# EAGLE design 01 (EAGLE 9.6.2)

## Sheet 1 of 4
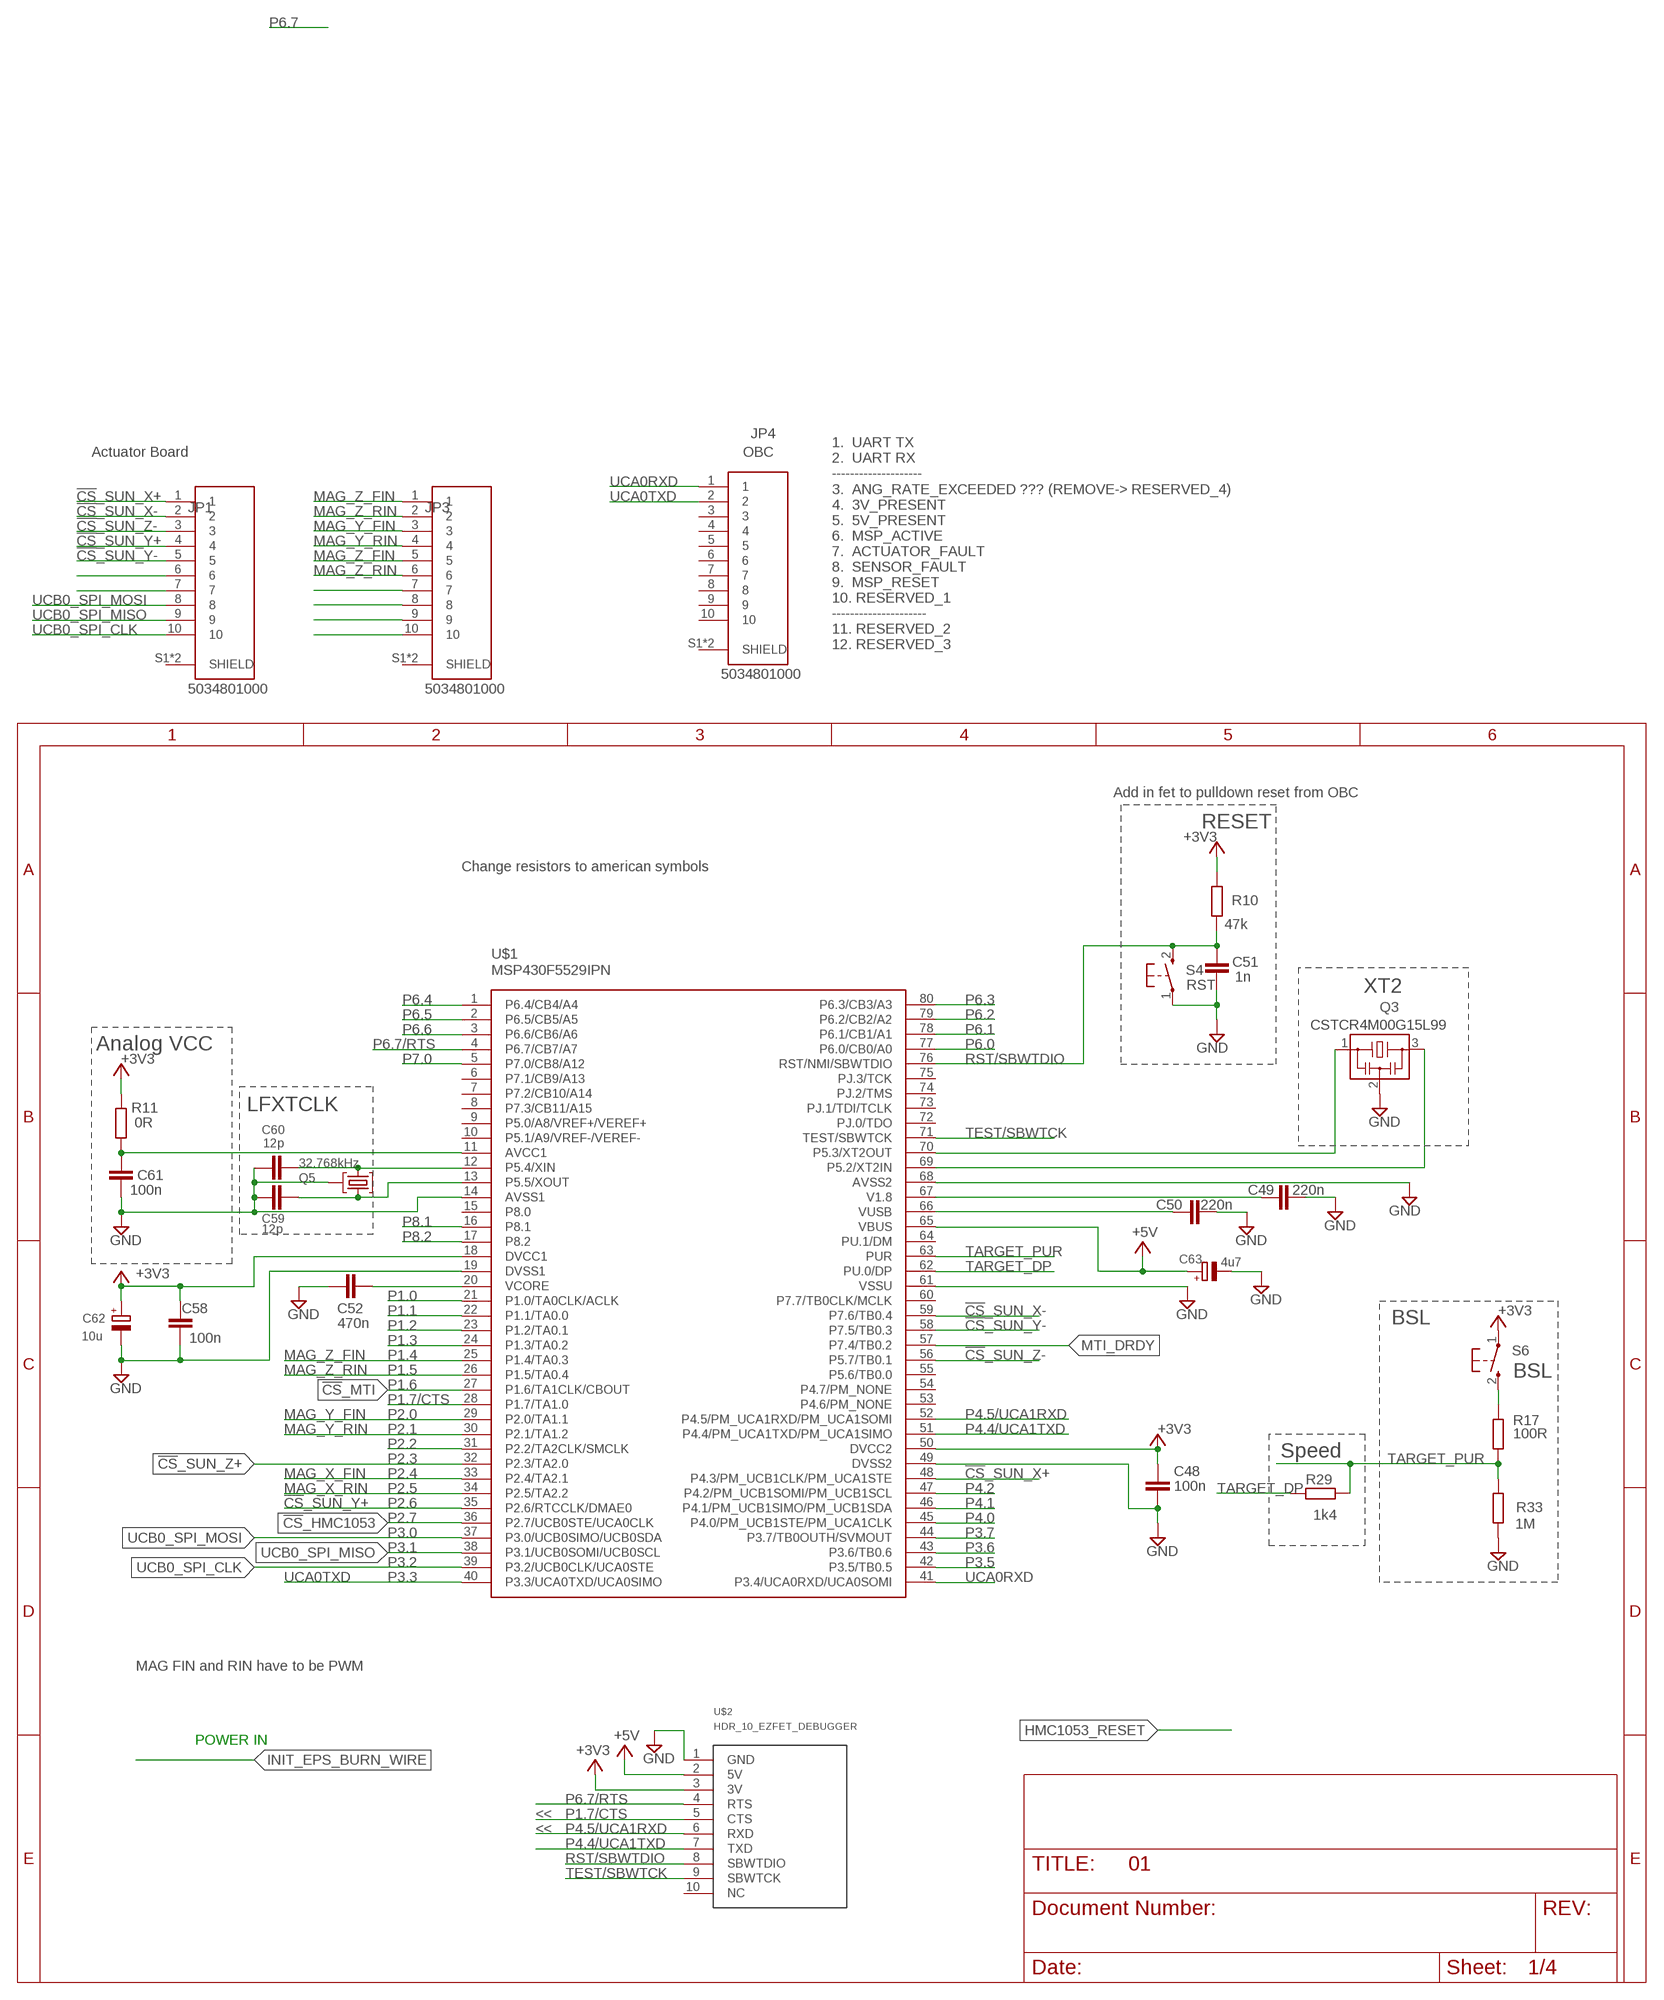
[diagram p0: schematic, sheet 1]

### Parts
C48  100n  C-EUCM0402  [0402]
C49  220n  C-EUCM0402  [0402]
C50  220n  C-EUCM0402  [0402]
C51  1n  C-EUCM0402  [0402]
C52  470n  C-EUCM0402  [0402]
C58  100n  C-EUCM0402  [0402]
C59  12p  C-EUCM0402  [0402]
C60  12p  C-EUCM0402  [0402]
C61  100n  C-EUCM0402  [0402]
C62  10u  CPOL-EUA/3216-18R  [A/3216-18R]
C63  4u7  CPOL-EUA/3216-18R  [A/3216-18R]
JP1  5034801000  [MOLEX_5034801000]
JP3  5034801000  [MOLEX_5034801000]
JP4  5034801000  [MOLEX_5034801000]
Q3  CSTCR4M00G15L99  MURATA-FILTER_CSTCR6M00G53Z  [MURATA-FILTER_CSTCR]
Q5  32.768kHz  MS3V-T1R  [MS3V-T1R]
R10  47k  R-EU_RM0402  [0402]
R11  0R  R-EU_RM0402  [0402]
R17  100R  R-EU_RM0402  [0402]
R29  1k4  R-EU_RM0402  [0402]
R33  1M  R-EU_RM0402  [0402]
S4  RST  PB  [PBTH]
S6  BSL  PB  [PBTH]
U$1  MSP430F5529IPN  [QFP80P50_1400X1400X160L60X22N]
U$2  HDR_10_EZFET_DEBUGGER  [HDRV10W66P254_10X1_2540X254H858]

### Nets
!CS!_HMC1053: U$1.36(P2.7/UCB0STE/UCA0CLK) ; also sheet 2,3
!CS!_MTI: U$1.27(P1.6/TA1CLK/CBOUT)
!CS!_SUN_X+: JP1.1 U$1.48(P4.3/PM_UCB1CLK/PM_UCA1STE)
!CS!_SUN_X-: JP1.2 U$1.59(P7.6/TB0.4)
!CS!_SUN_Y+: JP1.4 U$1.35(P2.6/RTCCLK/DMAE0)
!CS!_SUN_Y-: JP1.5 U$1.58(P7.5/TB0.3)
!CS!_SUN_Z+: U$1.32(P2.3/TA2.0)
!CS!_SUN_Z-: JP1.3 U$1.56(P5.7/TB0.1) ; also sheet 4
+3V3: C48.1 C58.2 C62.+ R10.2 R11.2 S6.1(P) U$1.18(DVCC1) U$1.50(DVCC2) U$2.3(3V) ; also sheet 2,3,4
+5V: C63.+ U$1.65(VBUS) U$2.2(5V) ; also sheet 4
AVCC1 [Power]: C61.1 R11.1 U$1.11(AVCC1)
GND: C48.2 C49.2 C50.2 C51.2 C52.1 C58.1 C59.1 C60.1 C61.2 C62.- C63.- Q3.2 Q5.P3(GND) R33.1 S4.1(P) U$1.14(AVSS1) U$1.19(DVSS1) U$1.49(DVSS2) U$1.61(VSSU) U$1.68(AVSS2) U$2.1(GND) ; also sheet 2,3,4
MAG_X_FIN: U$1.33(P2.4/TA2.1)
MAG_X_RIN: U$1.34(P2.5/TA2.2)
MAG_Y_FIN: JP3.3 U$1.29(P2.0/TA1.1)
MAG_Y_RIN: JP3.4 U$1.30(P2.1/TA1.2)
MAG_Z_FIN: JP3.1 JP3.5 U$1.25(P1.4/TA0.3)
MAG_Z_RIN: JP3.2 JP3.6 U$1.26(P1.5/TA0.4)
MTI_DRDY: U$1.57(P7.4/TB0.2) ; also sheet 3
N$6: JP1.6
N$8: JP1.7
N$11: JP3.7
N$12: R17.1 S6.2(S)
N$13: JP3.8
N$15: JP3.9
N$16: JP3.10
P1.0: U$1.21(P1.0/TA0CLK/ACLK)
P1.1: U$1.22(P1.1/TA0.0)
P1.2: U$1.23(P1.2/TA0.1)
P1.3: U$1.24(P1.3/TA0.2)
P1.7/CTS: U$1.28(P1.7/TA1.0) U$2.5(CTS)
P2.2: U$1.31(P2.2/TA2CLK/SMCLK)
P3.5: U$1.42(P3.5/TB0.5)
P3.6: U$1.43(P3.6/TB0.6)
P3.7: U$1.44(P3.7/TB0OUTH/SVMOUT)
P4.0: U$1.45(P4.0/PM_UCB1STE/PM_UCA1CLK)
P4.1: U$1.46(P4.1/PM_UCB1SIMO/PM_UCB1SDA)
P4.2: U$1.47(P4.2/PM_UCB1SOMI/PM_UCB1SCL)
P4.4/UCA1TXD: U$1.51(P4.4/PM_UCA1TXD/PM_UCA1SIMO) U$2.7(TXD)
P4.5/UCA1RXD: U$1.52(P4.5/PM_UCA1RXD/PM_UCA1SOMI) U$2.6(RXD)
P5.2/XT2IN1: Q3.3 U$1.69(P5.2/XT2IN)
P5.3/XT2OUT1: Q3.1 U$1.70(P5.3/XT2OUT)
P5.4/XIN1: C60.2 Q5.P2 U$1.12(P5.4/XIN)
P5.5/XOUT1: C59.2 Q5.P1 U$1.13(P5.5/XOUT)
P6.0: U$1.77(P6.0/CB0/A0)
P6.1: U$1.78(P6.1/CB1/A1)
P6.2: U$1.79(P6.2/CB2/A2)
P6.3: U$1.80(P6.3/CB3/A3)
P6.4: U$1.1(P6.4/CB4/A4)
P6.5: U$1.2(P6.5/CB5/A5)
P6.6: U$1.3(P6.6/CB6/A6)
P6.7/RTS: U$1.4(P6.7/CB7/A7) U$2.4(RTS)
P7.0: U$1.5(P7.0/CB8/A12)
P8.1: U$1.16(P8.1)
P8.2: U$1.17(P8.2)
RST/SBWTDIO: C51.1 R10.1 S4.2(S) U$1.76(RST/NMI/SBWTDIO) U$2.8(SBWTDIO)
TARGET_DP: R29.2 U$1.62(PU.0/DP)
TARGET_PUR: R17.2 R29.1 R33.2 U$1.63(PUR)
TARGET_VUSB1 [Power]: C50.1 U$1.66(VUSB)
TEST/SBWTCK: U$1.71(TEST/SBWTCK) U$2.9(SBWTCK)
UCA0RXD: JP4.1 U$1.41(P3.4/UCA0RXD/UCA0SOMI)
UCA0TXD: JP4.2 U$1.40(P3.3/UCA0TXD/UCA0SIMO)
UCB0_SPI_CLK: JP1.10 U$1.39(P3.2/UCB0CLK/UCA0STE) ; also sheet 2,3,4
UCB0_SPI_MISO: JP1.9 U$1.38(P3.1/UCB0SOMI/UCB0SCL) ; also sheet 2,3,4
UCB0_SPI_MOSI: JP1.8 U$1.37(P3.0/UCB0SIMO/UCB0SDA) ; also sheet 2,3,4
V1 [Power]: C49.1 U$1.67(V1.8)
VCORE1 [Power]: C52.2 U$1.20(VCORE)
Unconnected: JP1.S1(SHIELD) JP1.S2(SHIELD) JP3.S1(SHIELD) JP3.S2(SHIELD) JP4.3 JP4.4 JP4.5 JP4.6 JP4.7 JP4.8 JP4.9 JP4.10 JP4.S1(SHIELD) JP4.S2(SHIELD) U$1.6(P7.1/CB9/A13) U$1.7(P7.2/CB10/A14) U$1.8(P7.3/CB11/A15) U$1.9(P5.0/A8/VREF+/VEREF+) U$1.10(P5.1/A9/VREF-/VEREF-) U$1.15(P8.0) U$1.53(P4.6/PM_NONE) U$1.54(P4.7/PM_NONE) U$1.55(P5.6/TB0.0) U$1.60(P7.7/TB0CLK/MCLK) U$1.64(PU.1/DM) U$1.72(PJ.0/TDO) U$1.73(PJ.1/TDI/TCLK) U$1.74(PJ.2/TMS) U$1.75(PJ.3/TCK) U$2.10(NC)

### Notes on the sheet
- Actuator Board | OBC
- 1.  UART TX
  2.  UART RX
  --------------------
  3.  ANG_RATE_EXCEEDED ??? (REMOVE-> RESERVED_4)
  4.  3V_PRESENT
  5.  5V_PRESENT
  6.  MSP_ACTIVE
  7.  ACTUATOR_FAULT
  8.  SENSOR_FAULT
  9.  MSP_RESET
  10. RESERVED_1
  --------------------- 
  11. RESERVED_2
  12. RESERVED_3
- Add in fet to pulldown reset from OBC
- RESET
- Change resistors to american symbols
- XT2
- Analog VCC
- LFXTCLK
- BSL
- P1.4
- P1.5
- P1.6
- P2.0
- P2.1
- Speed
- P2.3
- P2.4
- P2.5
- P2.6
- P2.7
- P3.0
- P3.1
- P3.2
- P3.3
- MAG FIN and RIN have to be PWM
- POWER IN
- <<
- <<

## Sheet 2 of 4
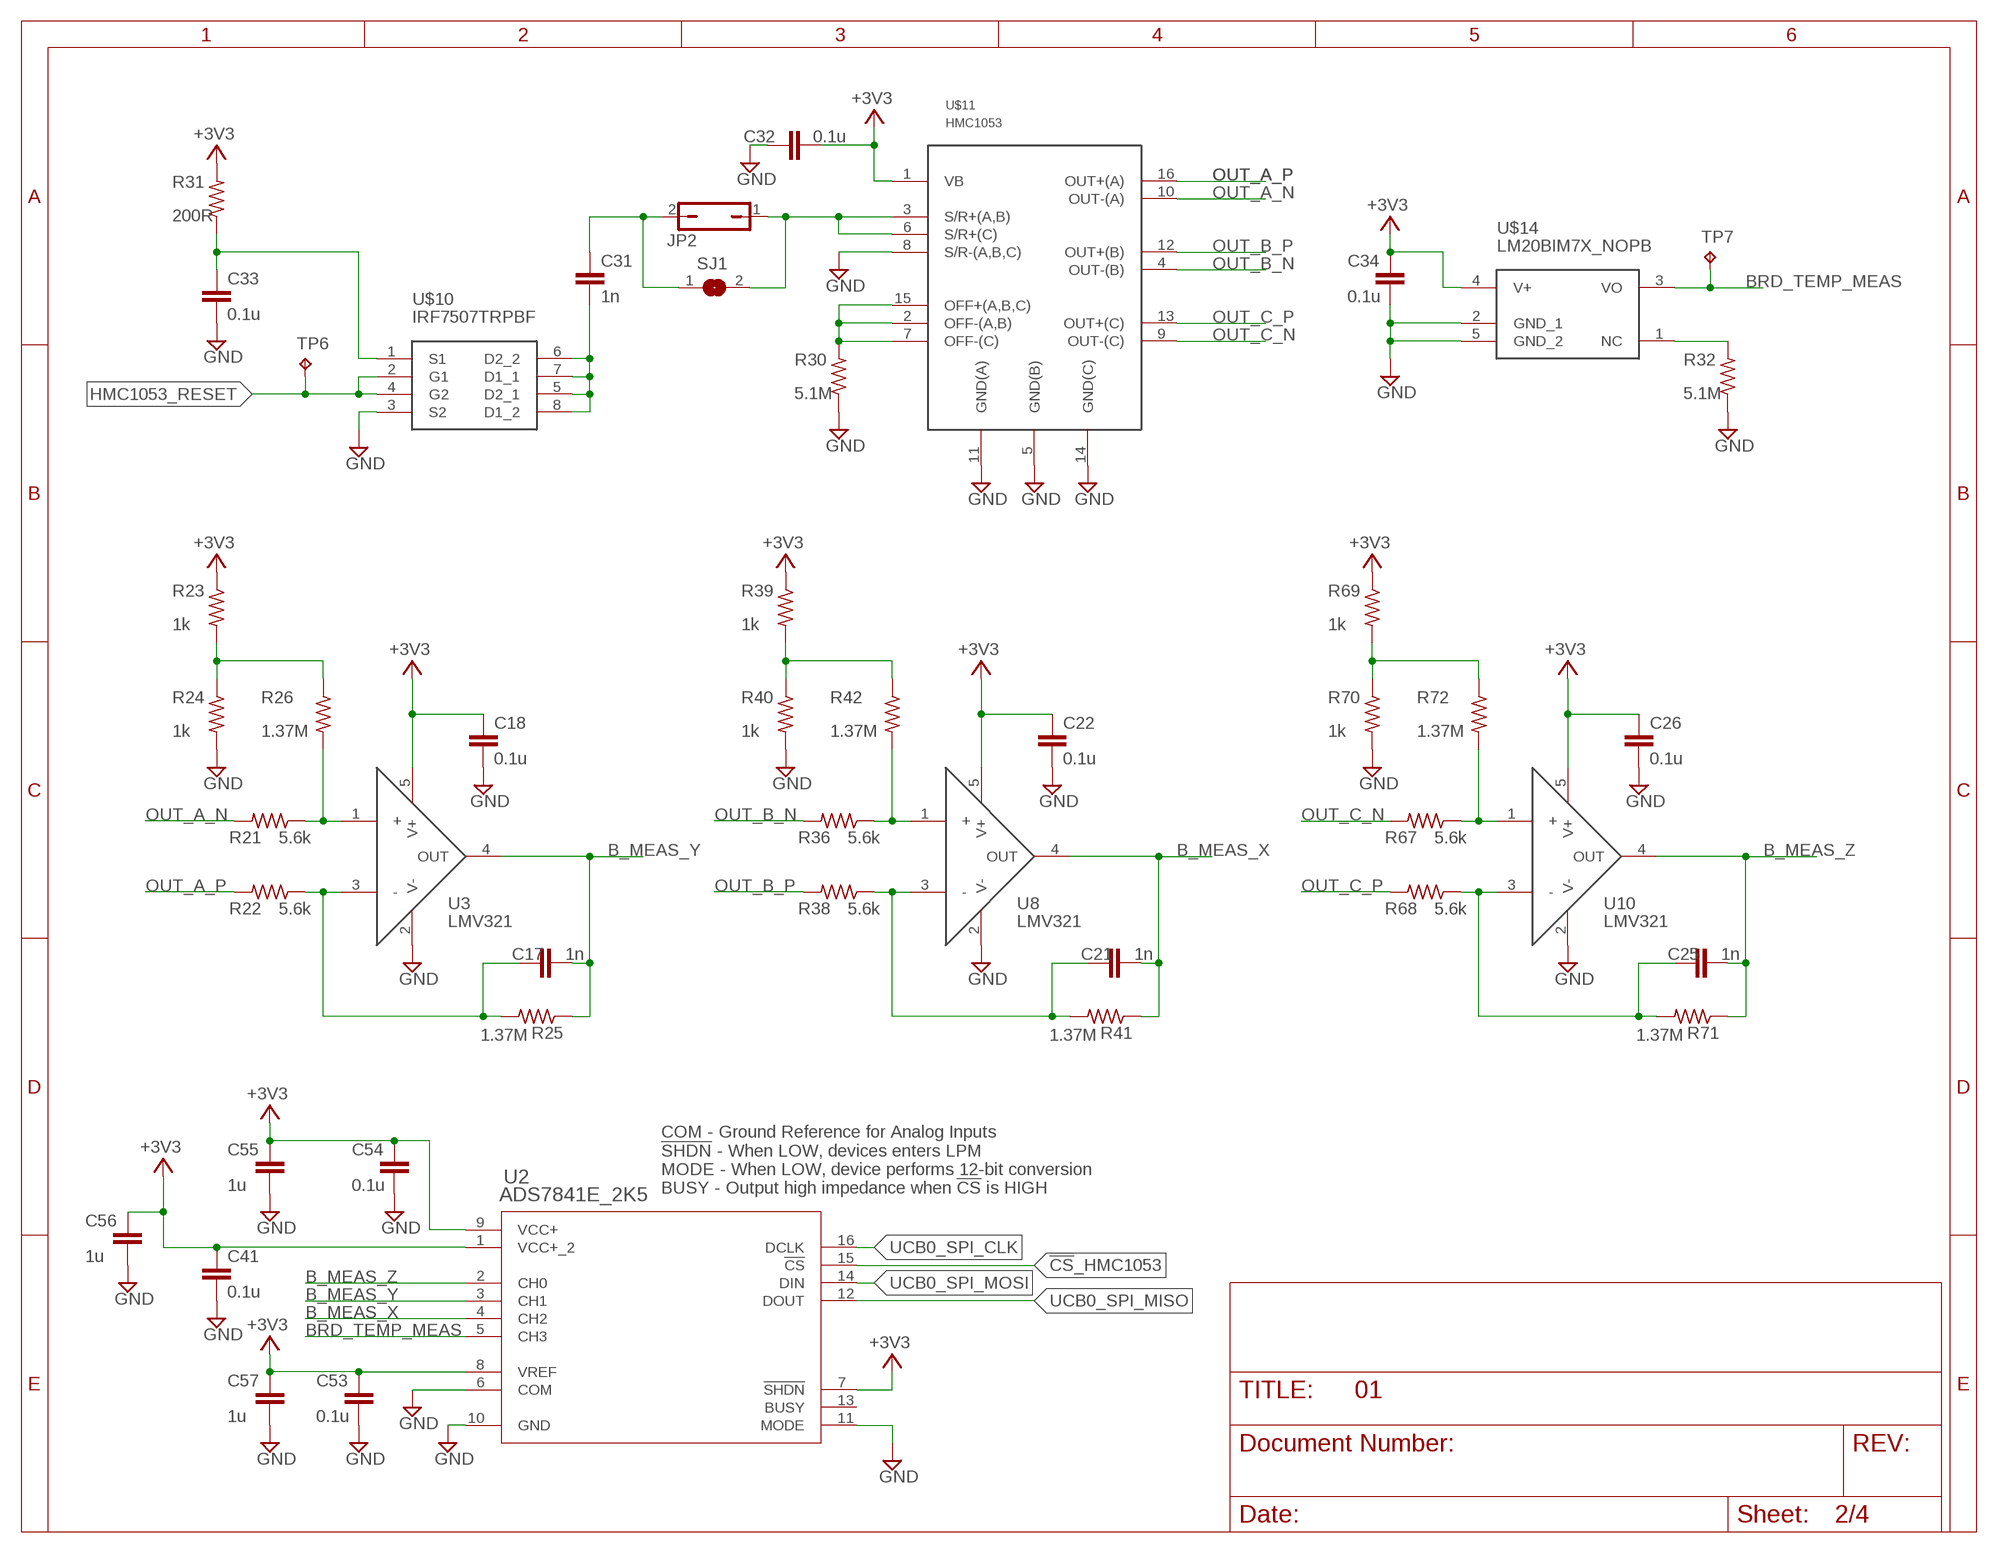
[diagram p1: schematic, sheet 2]

### Parts
C17  1n  C-EUC0805  [C0805]
C18  0.1u  C-EUC0603  [C0603]
C21  1n  C-EUC0805  [C0805]
C22  0.1u  C-EUC0603  [C0603]
C25  1n  C-EUC0805  [C0805]
C26  0.1u  C-EUC0603  [C0603]
C31  1n  C-EUC1206  [C1206]
C32  0.1u  C-EUC0603  [C0603]
C33  0.1u  C-EUC0603  [C0603]
C34  0.1u  C-EUC0603  [C0603]
C41  0.1u  C-EUC0603  [C0603]
C53  0.1u  C-EUC0603  [C0603]
C54  0.1u  C-EUC0603  [C0603]
C55  1u  C-EUC1206  [C1206]
C56  1u  C-EUC1206  [C1206]
C57  1u  C-EUC1206  [C1206]
JP2  JP1Q  [JP1]
R21  5.6k  R-US_R0805  [R0805]
R22  5.6k  R-US_R0805  [R0805]
R23  1k  R-US_R0805  [R0805]
R24  1k  R-US_R0805  [R0805]
R25  1.37M  R-US_R0805  [R0805]
R26  1.37M  R-US_R0805  [R0805]
R30  5.1M  R-US_R1206  [R1206]
R31  200R  R-US_R1206  [R1206]
R32  5.1M  R-US_R1206  [R1206]
R36  5.6k  R-US_R0805  [R0805]
R38  5.6k  R-US_R0805  [R0805]
R39  1k  R-US_R0805  [R0805]
R40  1k  R-US_R0805  [R0805]
R41  1.37M  R-US_R0805  [R0805]
R42  1.37M  R-US_R0805  [R0805]
R67  5.6k  R-US_R0805  [R0805]
R68  5.6k  R-US_R0805  [R0805]
R69  1k  R-US_R0805  [R0805]
R70  1k  R-US_R0805  [R0805]
R71  1.37M  R-US_R0805  [R0805]
R72  1.37M  R-US_R0805  [R0805]
SJ1  SJ  [SJ]
TP6  TPPAD1-13  [P1-13]
TP7  TPB1,27  [B1,27]
U2  ADS7841E_2K5  [DBQ16]
U3  LMV321  [SOT23-5P65_210X110L36X22N]
U8  LMV321  [SOT23-5P65_210X110L36X22N]
U10  LMV321  [SOT23-5P65_210X110L36X22N]
U$10  IRF7507TRPBF  [SOP8P65_300X490X111L53X30N]
U$11  HMC1053  [LCCS16P127_736X736X279L127X50N]
U$14  LM20BIM7X_NOPB  [SOT23-5P65_210X110L40X22N_LM20]

### Nets
!CS!_HMC1053: U2.15(!CS) ; also sheet 1,3
+3V3: C18.1 C22.1 C26.1 C32.1 C34.2 C41.1 C53.1 C54.1 C55.1 C56.1 C57.1 R23.1 R31.2 R39.1 R69.1 U2.1(VCC+_2) U2.7(!SHDN) U2.8(VREF) U2.9(VCC+) U3.5(V+) U8.5(V+) U10.5(V+) U$11.1(VB) U$14.4(V+) ; also sheet 1,3,4
B_MEAS_X: C21.2 R41.1 U2.4(CH2) U8.4(OUT)
B_MEAS_Y: C17.2 R25.1 U2.3(CH1) U3.4(OUT)
B_MEAS_Z: C25.2 R71.1 U2.2(CH0) U10.4(OUT)
BRD_TEMP_MEAS: TP7.TP U2.5(CH3) U$14.3(VO)
GND: C18.2 C22.2 C26.2 C32.2 C33.1 C34.1 C41.2 C53.2 C54.2 C55.2 C56.2 C57.2 R24.2 R30.1 R32.1 R40.2 R70.2 U2.6(COM) U2.10(GND) U2.11(MODE) U3.2(V-) U8.2(V-) U10.2(V-) U$10.3(S2) U$11.5(GND(B)) U$11.8(S/R-(A,B,C)) U$11.11(GND(A)) U$11.14(GND(C)) U$14.2(GND_1) U$14.5(GND_2) ; also sheet 1,3,4
HMC1053_RESET: TP6.TP U$10.2(G1) U$10.4(G2) ; also sheet 1
N$20: R23.2 R24.1 R26.1
N$21: C17.1 R22.1 R25.2 U3.3(-)
N$23: R21.1 R26.2 U3.1(+)
N$35: C31.2 JP2.2 SJ1.1
N$36: R30.2 U$11.2(OFF-(A,B)) U$11.7(OFF-(C)) U$11.15(OFF+(A,B,C))
N$37: JP2.1 SJ1.2 U$11.3(S/R+(A,B)) U$11.6(S/R+(C))
N$38: C31.1 U$10.5(D2_1) U$10.6(D2_2) U$10.7(D1_1) U$10.8(D1_2)
N$39: C33.2 R31.1 U$10.1(S1)
N$40: R32.2 U$14.1(NC)
N$49: R39.2 R40.1 R42.1
N$50: C21.1 R38.1 R41.2 U8.3(-)
N$52: R36.1 R42.2 U8.1(+)
N$59: R69.2 R70.1 R72.1
N$60: C25.1 R68.1 R71.2 U10.3(-)
N$62: R67.1 R72.2 U10.1(+)
OUT_A_N: R21.2 U$11.10(OUT-(A))
OUT_A_P: R22.2 U$11.16(OUT+(A))
OUT_B_N [Ground]: R36.2 U$11.4(OUT-(B))
OUT_B_P [Ground]: R38.2 U$11.12(OUT+(B))
OUT_C_N [Ground]: R67.2 U$11.9(OUT-(C))
OUT_C_P [Ground]: R68.2 U$11.13(OUT+(C))
UCB0_SPI_CLK: U2.16(DCLK) ; also sheet 1,3,4
UCB0_SPI_MISO: U2.12(DOUT) ; also sheet 1,3,4
UCB0_SPI_MOSI: U2.14(DIN) ; also sheet 1,3,4
Unconnected: U2.13(BUSY)

### Notes on the sheet
- COM - Ground Reference for Analog Inputs
  !SHDN! - When LOW, devices enters LPM
  MODE - When LOW, device performs 12-bit conversion
  BUSY - Output high impedance when !CS! is HIGH

## Sheet 3 of 4
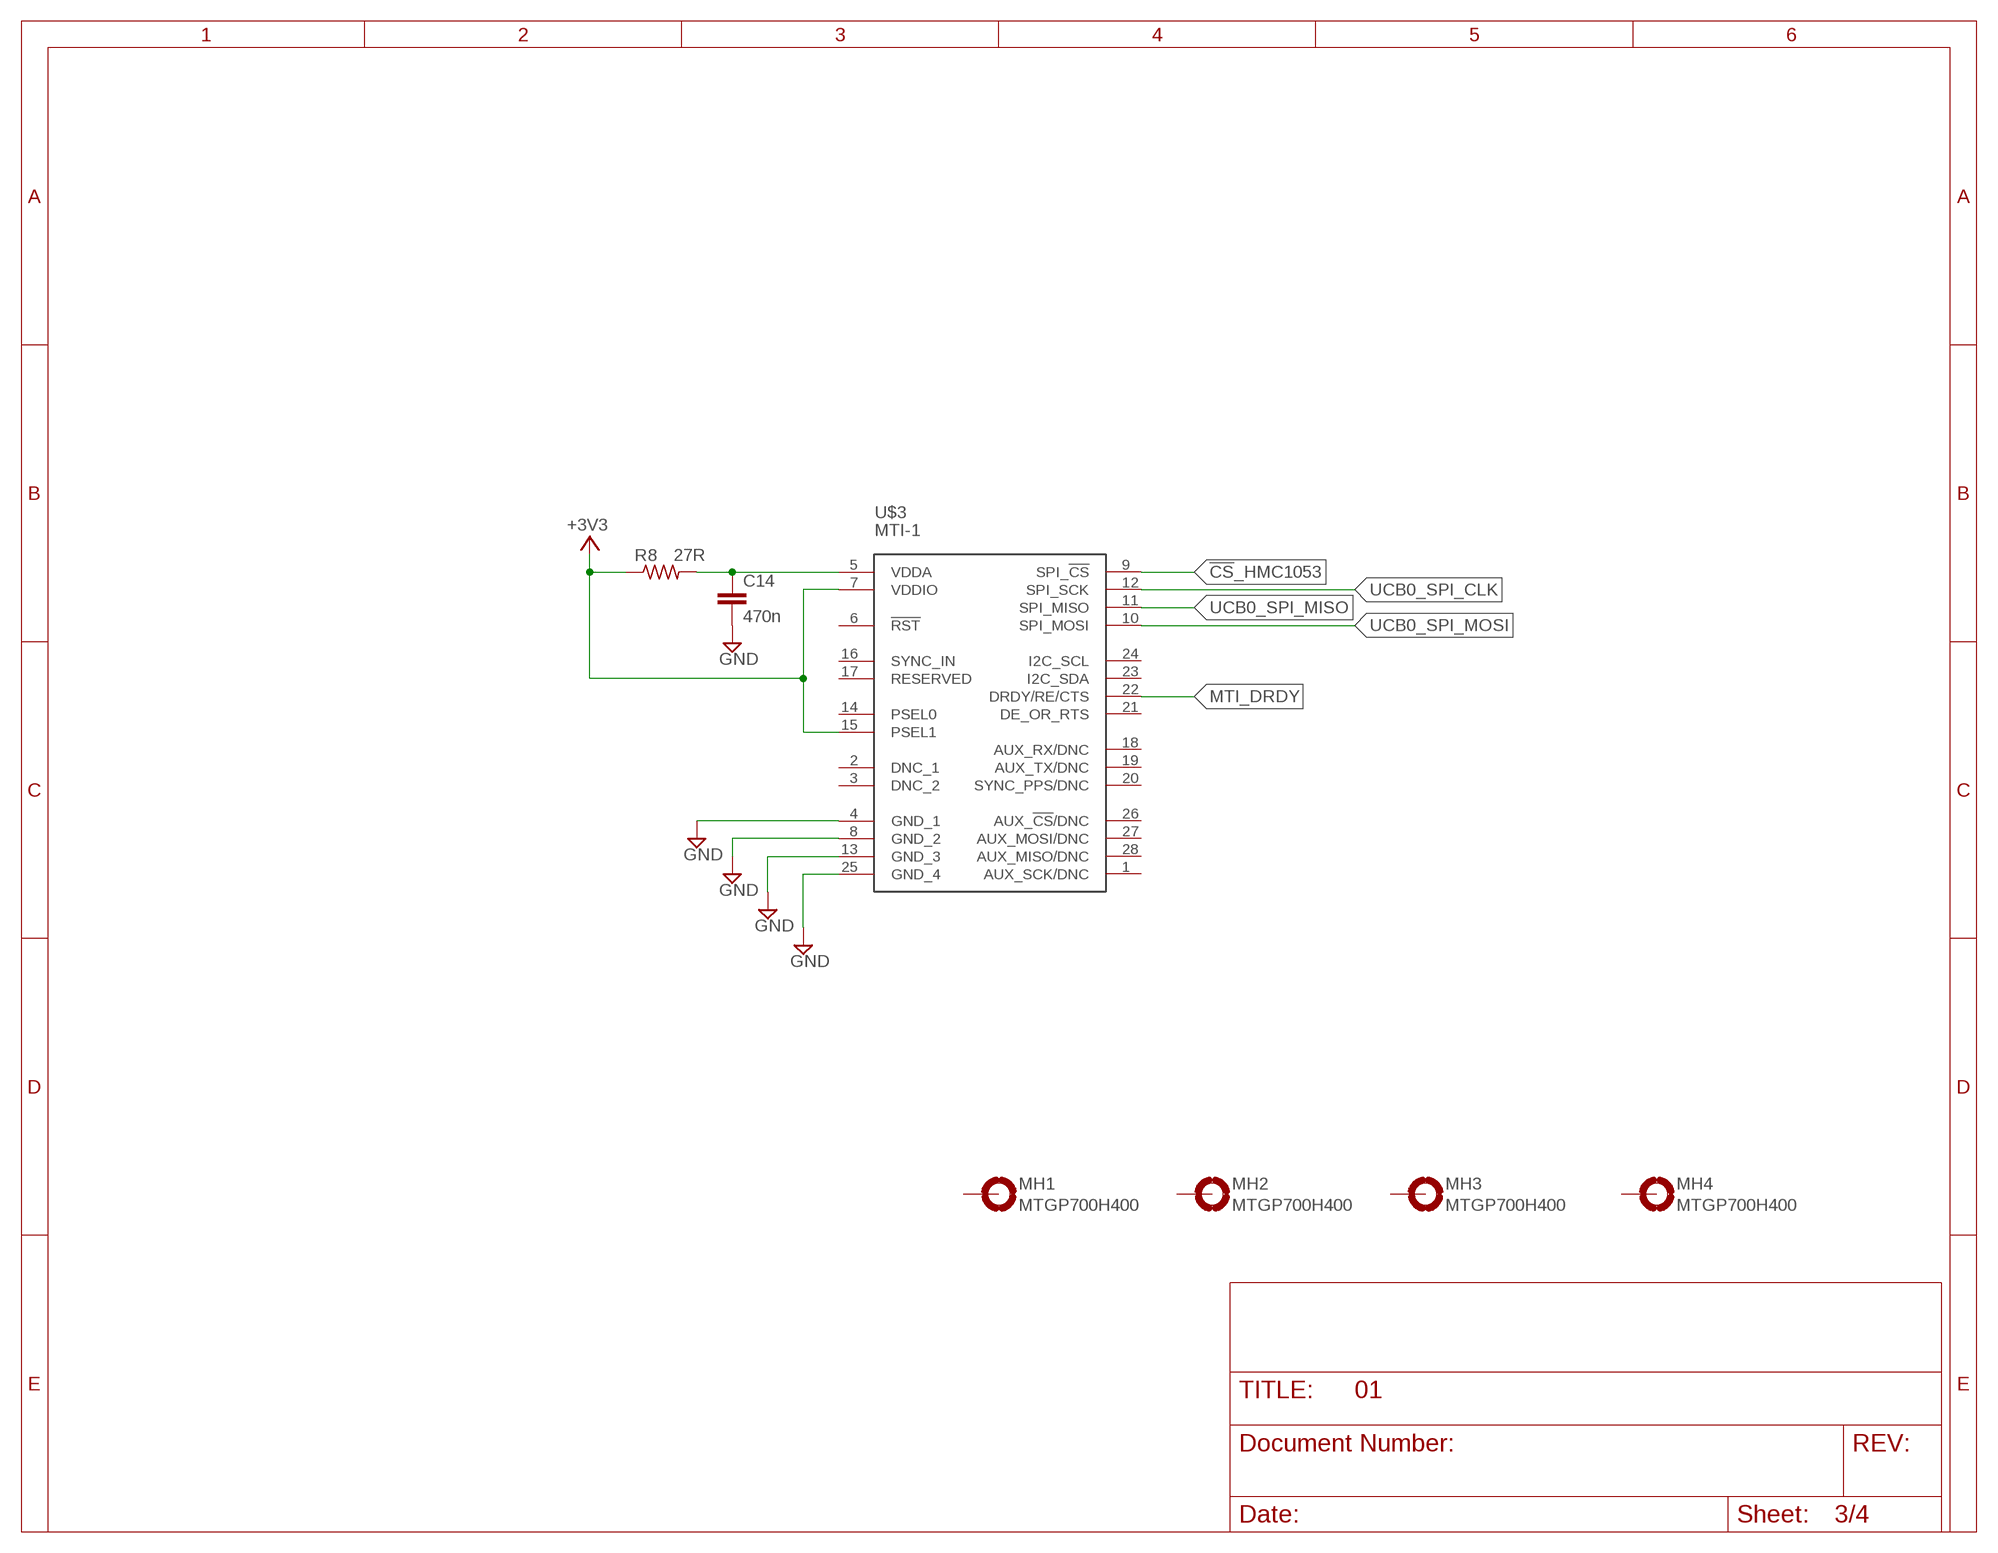
[diagram p2: schematic, sheet 3]

### Parts
C14  470n  C-EUC0805  [C0805]
MH1  MTGP700H400  [MTGP700H400]
MH2  MTGP700H400  [MTGP700H400]
MH3  MTGP700H400  [MTGP700H400]
MH4  MTGP700H400  [MTGP700H400]
R8  27R  R-US_R0805  [R0805]
U$3  MTI-1  [LCC28P127_1210X1210X260L90X63_MTI-1]

### Nets
!CS!_HMC1053: U$3.9(SPI_!CS) ; also sheet 1,2
+3V3: R8.1 U$3.7(VDDIO) U$3.15(PSEL1) ; also sheet 1,2,4
GND: C14.1 U$3.4(GND_1) U$3.8(GND_2) U$3.13(GND_3) U$3.25(GND_4) ; also sheet 1,2,4
MTI_DRDY: U$3.22(DRDY/RE/CTS) ; also sheet 1
N$7: C14.2 R8.2 U$3.5(VDDA)
UCB0_SPI_CLK: U$3.12(SPI_SCK) ; also sheet 1,2,4
UCB0_SPI_MISO: U$3.11(SPI_MISO) ; also sheet 1,2,4
UCB0_SPI_MOSI: U$3.10(SPI_MOSI) ; also sheet 1,2,4
Unconnected: MH1.1(MOUNT) MH2.1(MOUNT) MH3.1(MOUNT) MH4.1(MOUNT) U$3.1(AUX_SCK/DNC) U$3.2(DNC_1) U$3.3(DNC_2) U$3.6(!RST) U$3.14(PSEL0) U$3.16(SYNC_IN) U$3.17(RESERVED) U$3.18(AUX_RX/DNC) U$3.19(AUX_TX/DNC) U$3.20(SYNC_PPS/DNC) U$3.21(DE_OR_RTS) U$3.23(I2C_SDA) U$3.24(I2C_SCL) U$3.26(AUX_!CS!/DNC) U$3.27(AUX_MOSI/DNC) U$3.28(AUX_MISO/DNC)

## Sheet 4 of 4
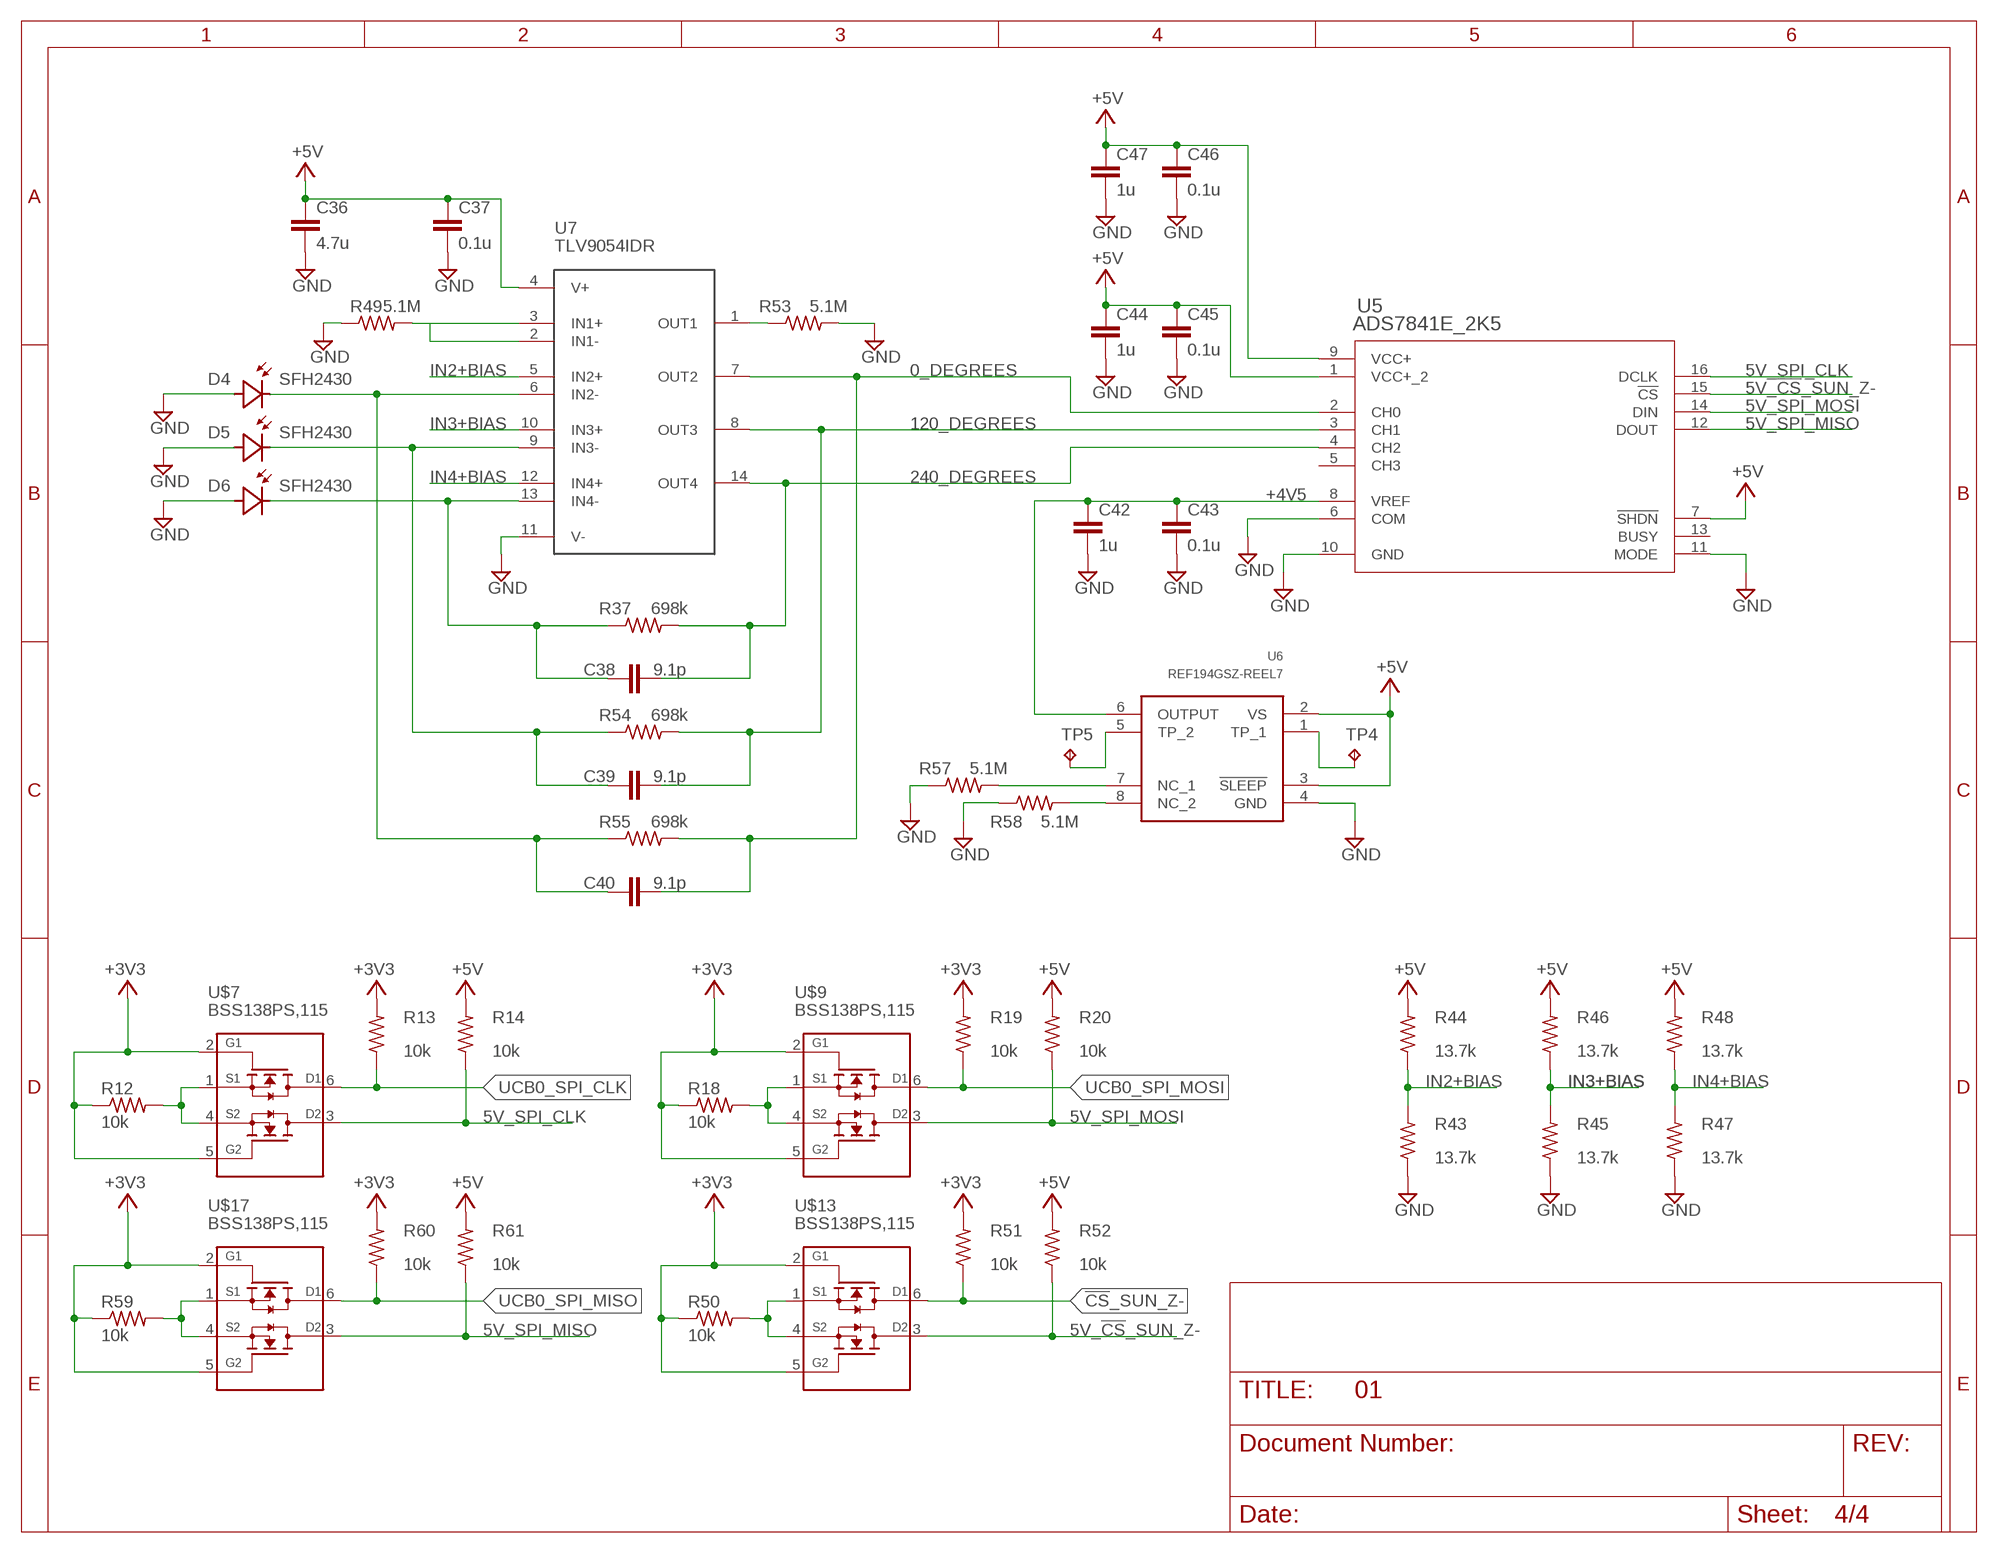
[diagram p3: schematic, sheet 4]

### Parts
C36  4.7u  C-EUC0603  [C0603]
C37  0.1u  C-EUC0603  [C0603]
C38  9.1p  C-EUC0603  [C0603]
C39  9.1p  C-EUC0603  [C0603]
C40  9.1p  C-EUC0603  [C0603]
C42  1u  C-EUC0603  [C0603]
C43  0.1u  C-EUC0603  [C0603]
C44  1u  C-EUC0603  [C0603]
C45  0.1u  C-EUC0603  [C0603]
C46  0.1u  C-EUC0603  [C0603]
C47  1u  C-EUC0603  [C0603]
D4  SFH2430  [JP1Y_LED_SCREEN]
D5  SFH2430  [JP1Y_LED_SCREEN]
D6  SFH2430  [JP1Y_LED_SCREEN]
R12  10k  R-US_R0402  [R0402]
R13  10k  R-US_R0402  [R0402]
R14  10k  R-US_R0402  [R0402]
R18  10k  R-US_R0402  [R0402]
R19  10k  R-US_R0402  [R0402]
R20  10k  R-US_R0402  [R0402]
R37  698k  R-US_R0603  [R0603]
R43  13.7k  R-US_R0603  [R0603]
R44  13.7k  R-US_R0603  [R0603]
R45  13.7k  R-US_R0603  [R0603]
R46  13.7k  R-US_R0603  [R0603]
R47  13.7k  R-US_R0603  [R0603]
R48  13.7k  R-US_R0603  [R0603]
R49  5.1M  R-US_R0603  [R0603]
R50  10k  R-US_R0402  [R0402]
R51  10k  R-US_R0402  [R0402]
R52  10k  R-US_R0402  [R0402]
R53  5.1M  R-US_R0603  [R0603]
R54  698k  R-US_R0603  [R0603]
R55  698k  R-US_R0603  [R0603]
R57  5.1M  R-US_R0603  [R0603]
R58  5.1M  R-US_R0603  [R0603]
R59  10k  R-US_R0402  [R0402]
R60  10k  R-US_R0402  [R0402]
R61  10k  R-US_R0402  [R0402]
TP4  TPB1,27  [B1,27]
TP5  TPB1,27  [B1,27]
U5  ADS7841E_2K5  [DBQ16]
U6  REF194GSZ-REEL7  [SOIC8P127_490X600X175L83X41N_REF194GSZ-REEL7]
U7  TLV9054IDR  [SOIC14P127_865X600X175L83X41N_TLV9054IDR]
U$7  BSS138PS,115  [SOT23-6P65_200X110L30X25N_BSS138PS,115]
U$9  BSS138PS,115  [SOT23-6P65_200X110L30X25N_BSS138PS,115]
U$13  BSS138PS,115  [SOT23-6P65_200X110L30X25N_BSS138PS,115]
U$17  BSS138PS,115  [SOT23-6P65_200X110L30X25N_BSS138PS,115]

### Nets
0_DEGREES: C40.2 R55.2 U5.2(CH0) U7.7(OUT2)
5V_!CS!_SUN_Z-: R52.1 U5.15(!CS) U$13.3(D2)
5V_SPI_CLK: R14.1 U5.16(DCLK) U$7.3(D2)
5V_SPI_MISO: R61.1 U5.12(DOUT) U$17.3(D2)
5V_SPI_MOSI: R20.1 U5.14(DIN) U$9.3(D2)
120_DEGREES: C39.2 R54.2 U5.3(CH1) U7.8(OUT3)
240_DEGREES: C38.2 R37.2 U5.4(CH2) U7.14(OUT4)
!CS!_SUN_Z-: R51.1 U$13.6(D1) ; also sheet 1
+3V3: R12.1 R13.2 R18.1 R19.2 R50.1 R51.2 R59.1 R60.2 U$7.2(G1) U$7.5(G2) U$9.2(G1) U$9.5(G2) U$13.2(G1) U$13.5(G2) U$17.2(G1) U$17.5(G2) ; also sheet 1,2,3
+4V5: C42.1 C43.1 U5.8(VREF) U6.6(OUTPUT)
+5V: C36.1 C37.1 C44.1 C45.1 C46.1 C47.1 R14.2 R20.2 R44.2 R46.2 R48.2 R52.2 R61.2 U5.1(VCC+_2) U5.7(!SHDN) U5.9(VCC+) U6.2(VS) U6.3(!SLEEP) U7.4(V+) ; also sheet 1
GND: C36.2 C37.2 C42.2 C43.2 C44.2 C45.2 C46.2 C47.2 D4.2(A) D5.2(A) D6.2(A) R43.1 R45.1 R47.1 R49.1 R53.2 R57.1 R58.1 U5.6(COM) U5.10(GND) U5.11(MODE) U6.4(GND) U7.11(V-) ; also sheet 1,2,3
IN2+BIAS: R43.2 R44.1 U7.5(IN2+)
IN3+BIAS: R45.2 R46.1 U7.10(IN3+)
IN4+BIAS: R47.2 R48.1 U7.12(IN4+)
N$14: R12.2 U$7.1(S1) U$7.4(S2)
N$26: R49.2 U7.2(IN1-) U7.3(IN1+)
N$27: R53.1 U7.1(OUT1)
N$28: C38.1 D6.1(C) R37.1 U7.13(IN4-)
N$30: R18.2 U$9.1(S1) U$9.4(S2)
N$31: C39.1 D5.1(C) R54.1 U7.9(IN3-)
N$32: C40.1 D4.1(C) R55.1 U7.6(IN2-)
N$33: TP5.TP U6.5(TP_2)
N$34: TP4.TP U6.1(TP_1)
N$41: R57.2 U6.7(NC_1)
N$42: R50.2 U$13.1(S1) U$13.4(S2)
N$43: R58.2 U6.8(NC_2)
N$48: R59.2 U$17.1(S1) U$17.4(S2)
UCB0_SPI_CLK: R13.1 U$7.6(D1) ; also sheet 1,2,3
UCB0_SPI_MISO: R60.1 U$17.6(D1) ; also sheet 1,2,3
UCB0_SPI_MOSI: R19.1 U$9.6(D1) ; also sheet 1,2,3
Unconnected: U5.5(CH3) U5.13(BUSY)

## Library data of the parts
C14 C17 C18 C21 C22 C25 C26 C32-C34 C36-C47 C53 C54 = rcl:C-EU: CAPACITOR, European symbol; SPICEPREFIX: C
C31 C55-C57 = resistor:C-EU: CAPACITOR, European symbol
C48-C52 C58-C61 = rcl:C-EU: CAPACITOR, European symbol
C62 C63 = rcl:CPOL-EU: POLARIZED CAPACITOR, European symbol
D4-D6 = my_library:SFH2430
JP1 JP3 JP4 = my_library:5034801000: 0.50mm Pitch Easy-On™ BackFlip™ Type FPC Connector, 1.00mm Height, Right Angle, Surface Mount, Dual Contact Style; DESCRIPTION: 10 Position FFC, FPC Connector Contacts, Top and Bottom 0.020 (0.50mm) Surface Mount, Right Angle; DIGI-KEY_PART_NUMBER: WM1389CT-ND; MF: Molex; MP: 5034801000; PACKAGE: None; PURCHASE-URL: https://pricing.snapeda.com/search/part/5034801000/?ref=eda
JP2 = jumper:JP1Q: JUMPER
MH1-MH4 = my_library:MTGP700H400
Q3 = murata:MURATA-FILTER_CSTCR: Resonator Source: murata.co.jp; MPN: CSTCR6M00G53-R0; OC_FARNELL: 1170434; OC_NEWARK: 25M8759
Q5 = microcrystal:MS3V-T1R
R8 R12-R14 R18-R26 R36-R55 R57-R61 R67-R72 = rcl:R-US_: RESISTOR, American symbol; SPICEPREFIX: R
R10 R11 R17 R29 R33 = rcl:R-EU_: RESISTOR, European symbol
R30-R32 = resistor:R-US_: RESISTOR, American symbol
S4 S6 = electricalmeter:PB: OMRON SWITCH
SJ1 = jumper:SJ: SMD solder JUMPER
TP4-TP7 = testpad:TP: Test pad
U2 U5 = my_library:ADS7841E_2K5; DATASHEET_URL: http://www.ti.com/lit/gpn/ADS7841; DESCRIPTION: 12-Bit, 4-Channel Serial Output Sampling Analog-to-Digital Converter; FAMILY_NAME: PRECISION ADC (<=10MSPS); GENERIC_PART_NUMBER: ADS7841; INDUSTRY_STD_PKG_TYPE: SSOP/QSOP; MANUFACTURER: Texas Instruments; PACKAGE_DESIGNATOR: DBQ; PIN_COUNT: 16
U3 U8 U10 = my_library:LMV321
U6 = my_library:REF194GSZ-REEL7
U7 = my_library:TLV9054IDR
U$1 = my_library:MSP430F5529IPN
U$2 = my_library:HDR_10_EZFET_DEBUGGER
U$3 = my_library:MTI-1
U$7 U$9 U$13 U$17 = my_library:BSS138PS,115
U$10 = my_library:IRF7507TRPBF
U$11 = my_library:HMC1053
U$14 = my_library:LM20BIM7X_NOPB

## Net classes
0 Default: width 0.203 mm, drill 0.305 mm, clearance 0.152 mm
1 Ground: width 0.203 mm, drill 0.305 mm, clearance 0.152 mm to class 0, clearance 0.152 mm
2 Power: width 0.203 mm, drill 0.305 mm, clearance 0.152 mm to class 0, clearance 0.152 mm to class 1, clearance 0.152 mm

## Board
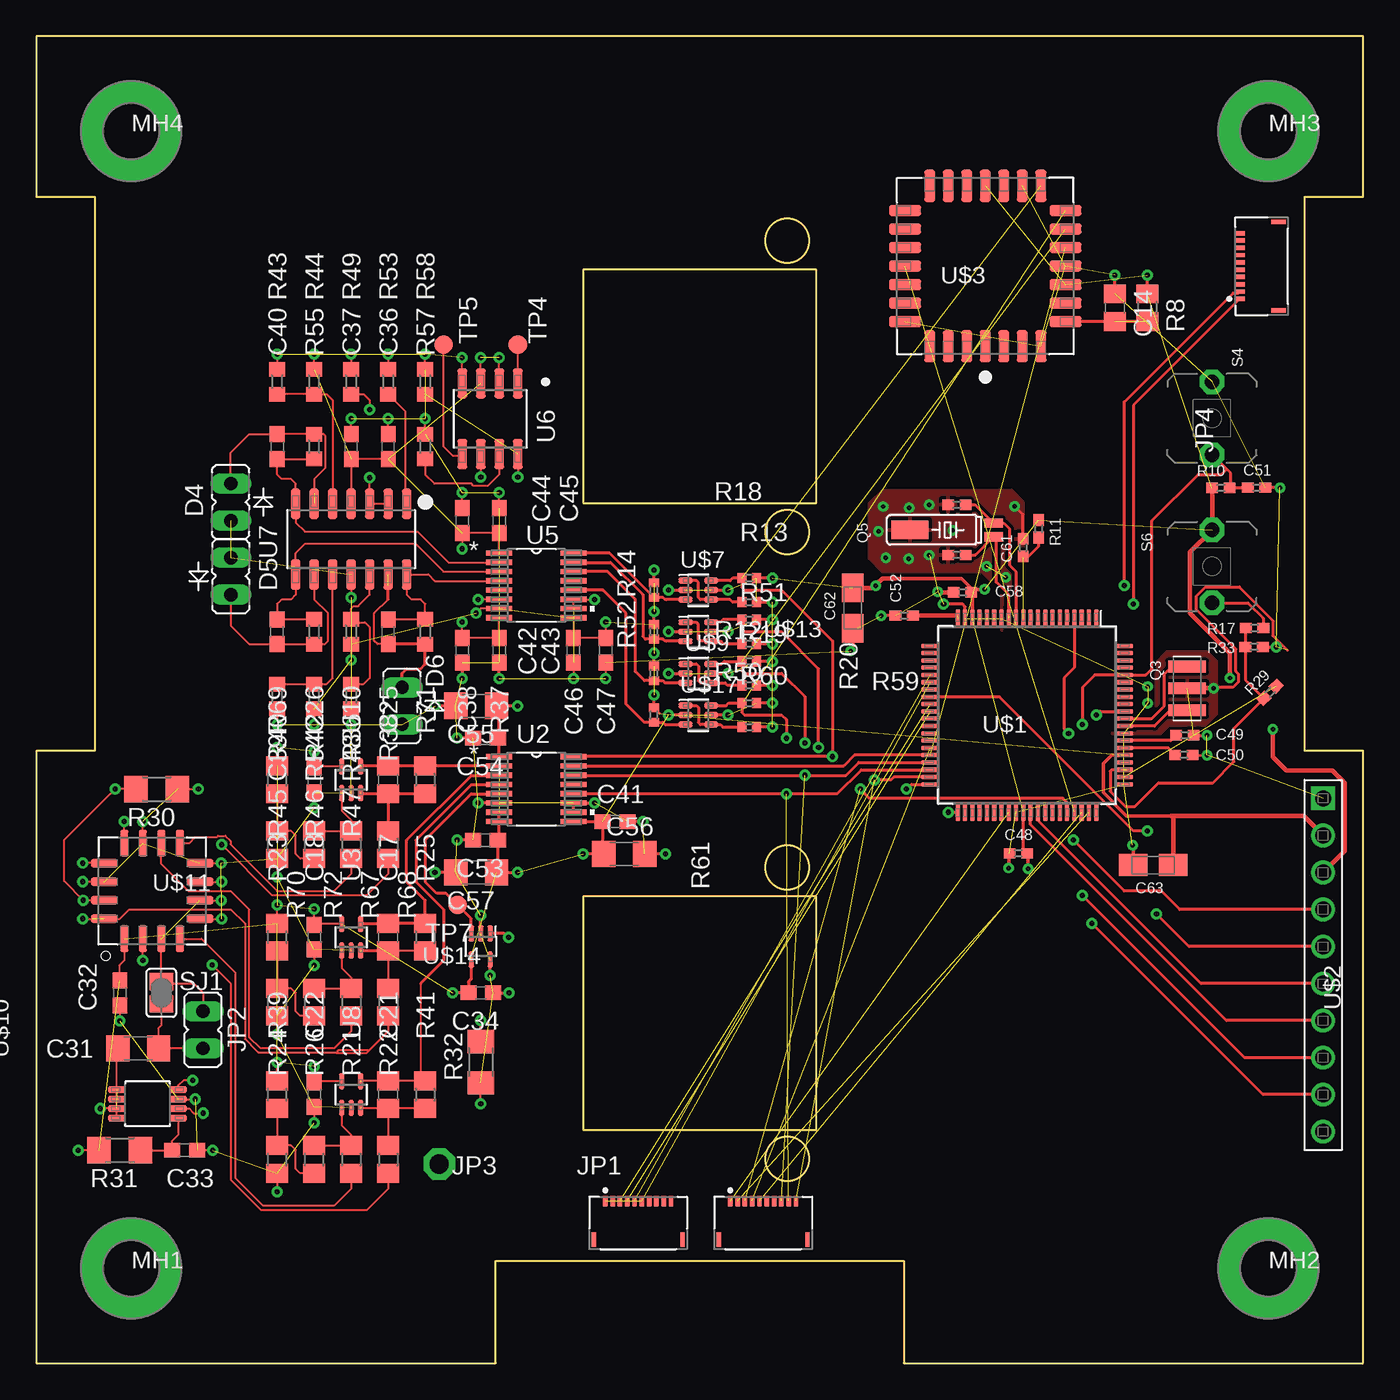
[diagram p4: board, top side]
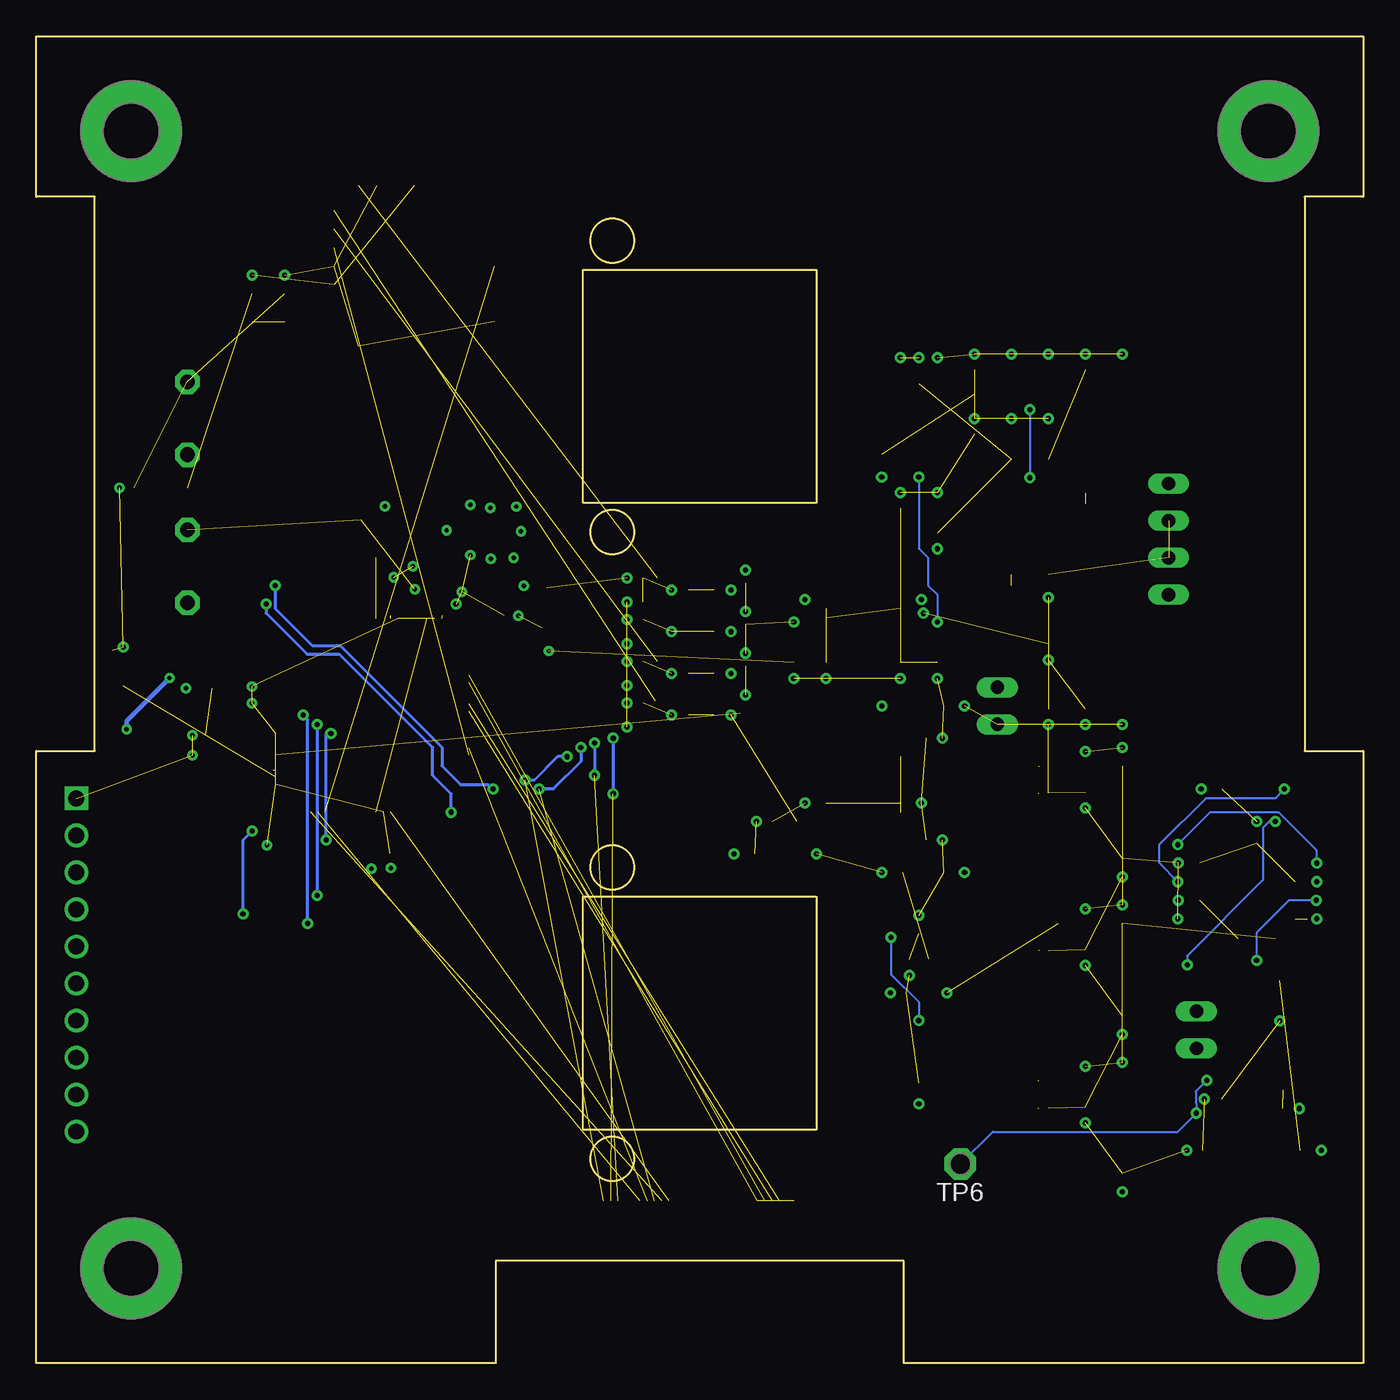
[diagram p5: board, bottom side, seen from below]

Size 91 x 91 mm. Coordinates in mm from the lower left corner, seen from the top.
Outline: 0,0 31.5,0 31.5,7 59.5,7 59.5,0 91,0 91,42 87,42 87,80 91,80 91,91 0,91 0,80 4,80 4,42 0,42 0,0
Copper layers (1*16): Top 0.035mm / dielectric 1.5mm / Bottom 0.035mm
Design rules "default": minimum track width 6mil, minimum drill 0.35mm, track to track 6mil, track to pad 6mil, pad to pad 6mil, via to via 6mil, smd to smd 6mil, copper to edge 40mil, drill to drill 6mil, minimum pad ring 10mil, minimum via ring 8mil, stop-mask expansion 4mil, vias tented up to drill 0mil, thermal gap 10mil
Milling: area 50,75.5 to 53,78.5; area 50,55.5 to 53,58.5; area 50,32.5 to 53,35.5; area 50,12.5 to 53,15.5; 8 lines

### Footprints (pad centres in the part's own frame; a part is rotated, then mirrored left to right if it is on the bottom)
C0805 = smd 1.3 x 1.5: 1 -0.95,0; 2 0.95,0
C0603 = smd 1.1 x 1: 1 -0.85,0; 2 0.85,0
C1206 = smd 1.6 x 1.8: 1 -1.4,0; 2 1.4,0
0402 = smd 0.8 x 0.7: 1 -0.6,0; 2 0.6,0
A/3216-18R = smd 1.95 x 1.5: + 1.375,0; - -1.375,0
JP1Y_LED_SCREEN = drill 0.914 long: 1 0,-1.27; 2 0,1.27
MOLEX_5034801000 = smd 0.3 x 0.7: 1 -2.25,0; 2 -1.75,0; 3 -1.25,0; 4 -0.75,0; 5 -0.25,0; 6 0.25,0; 7 0.75,0; 8 1.25,0; 9 1.75,0; 10 2.25,0 | smd 0.3 x 1: S1 -3.04,-2.65; S2 3.04,-2.65
JP1 = drill 0.914 long: 1 0,-1.27; 2 0,1.27
MTGP700H400 = drill 4 pad 7: 1 0,0
MURATA-FILTER_CSTCR = smd 0.8 x 2.6: 1 -1.5,0; 2 0,0; 3 1.5,0
MS3V-T1R = smd 0.635 x 1.27: P1 -0.47,-4.43; P2 0.47,-4.43 | smd 1.27 x 2.54: P3 0,1.3
R0805 = smd 1.3 x 1.5: 1 -0.95,0; 2 0.95,0
R0402 = smd 0.6 x 0.7: 1 -0.5,0; 2 0.5,0
R1206 = smd 1.6 x 1.803: 1 -1.422,0; 2 1.422,0
R0603 = smd 1 x 1.1: 1 -0.85,0; 2 0.85,0
PBTH = drill 1.016 pad 1.676 octagon: 1 -0.001,0.001; 2 5.001,0.001
SJ = smd 1.168 x 1.6: 1 -0.762,0; 2 0.762,0
B1,27 = smd 1.27 x 1.27: TP 0,0
P1-13 = drill 1.321 pad 2.159 octagon: TP 0,0
DBQ16 = smd 1.803 x 0.356: 1 -2.553,2.223; 2 -2.553,1.587; 3 -2.553,0.953; 4 -2.553,0.318; 5 -2.553,-0.318; 6 -2.553,-0.953; 7 -2.553,-1.587; 8 -2.553,-2.223; 9 2.553,-2.223; 10 2.553,-1.587; 11 2.553,-0.953; 12 2.553,-0.318; 13 2.553,0.318; 14 2.553,0.953; 15 2.553,1.587; 16 2.553,2.223
SOT23-5P65_210X110L36X22N = smd 0.38 x 1.09: 1 -0.65,-0.91; 2 0,-0.91; 3 0.65,-0.91; 4 0.65,0.91; 5 -0.65,0.91
SOIC8P127_490X600X175L83X41N_REF194GSZ-REEL7 = smd 0.66 x 2.07: 1 -1.905,-2.425; 2 -0.635,-2.425; 3 0.635,-2.425; 4 1.905,-2.425; 5 1.905,2.425; 6 0.635,2.425; 7 -0.635,2.425; 8 -1.905,2.425
SOIC14P127_865X600X175L83X41N_TLV9054IDR = smd 0.66 x 2.07: 1 -3.81,-2.425; 2 -2.54,-2.425; 3 -1.27,-2.425; 4 0,-2.425; 5 1.27,-2.425; 6 2.54,-2.425; 7 3.81,-2.425; 8 3.81,2.425; 9 2.54,2.425; 10 1.27,2.425; 11 0,2.425; 12 -1.27,2.425; 13 -2.54,2.425; 14 -3.81,2.425
QFP80P50_1400X1400X160L60X22N = smd 0.3 x 1.26: 1 -4.75,-6.63; 2 -4.25,-6.63; 3 -3.75,-6.63; 4 -3.25,-6.63; 5 -2.75,-6.63; 6 -2.25,-6.63; 7 -1.75,-6.63; 8 -1.25,-6.63; 9 -0.75,-6.63; 10 -0.25,-6.63; 11 0.25,-6.63; 12 0.75,-6.63; 13 1.25,-6.63; 14 1.75,-6.63; 15 2.25,-6.63; 16 2.75,-6.63; 17 3.25,-6.63; 18 3.75,-6.63; 19 4.25,-6.63; 20 4.75,-6.63; 41 4.75,6.63; 42 4.25,6.63; 43 3.75,6.63; 44 3.25,6.63; 45 2.75,6.63; 46 2.25,6.63; 47 1.75,6.63; 48 1.25,6.63; 49 0.75,6.63; 50 0.25,6.63; 51 -0.25,6.63; 52 -0.75,6.63; 53 -1.25,6.63; 54 -1.75,6.63; 55 -2.25,6.63; 56 -2.75,6.63; 57 -3.25,6.63; 58 -3.75,6.63; 59 -4.25,6.63; 60 -4.75,6.63 | smd 1.26 x 0.3: 21 6.63,-4.75; 22 6.63,-4.25; 23 6.63,-3.75; 24 6.63,-3.25; 25 6.63,-2.75; 26 6.63,-2.25; 27 6.63,-1.75; 28 6.63,-1.25; 29 6.63,-0.75; 30 6.63,-0.25; 31 6.63,0.25; 32 6.63,0.75; 33 6.63,1.25; 34 6.63,1.75; 35 6.63,2.25; 36 6.63,2.75; 37 6.63,3.25; 38 6.63,3.75; 39 6.63,4.25; 40 6.63,4.75; 61 -6.63,4.75; 62 -6.63,4.25; 63 -6.63,3.75; 64 -6.63,3.25; 65 -6.63,2.75; 66 -6.63,2.25; 67 -6.63,1.75; 68 -6.63,1.25; 69 -6.63,0.75; 70 -6.63,0.25; 71 -6.63,-0.25; 72 -6.63,-0.75; 73 -6.63,-1.25; 74 -6.63,-1.75; 75 -6.63,-2.25; 76 -6.63,-2.75; 77 -6.63,-3.25; 78 -6.63,-3.75; 79 -6.63,-4.25; 80 -6.63,-4.75
HDRV10W66P254_10X1_2540X254H858 = drill 1.08 pad 1.62 square: 1 0,0 | drill 1.08 pad 1.62: 2 2.54,0; 3 5.08,0; 4 7.62,0; 5 10.16,0; 6 12.7,0; 7 15.24,0; 8 17.78,0; 9 20.32,0; 10 22.86,0
LCC28P127_1210X1210X260L90X63_MTI-1 = smd 0.76 x 2.21: 1 0,5.495 | smd 0.76 x 2.2: 2 -1.27,5.5; 3 -2.54,5.5; 4 -3.81,5.5; 12 -3.81,-5.5; 13 -2.54,-5.5; 14 -1.27,-5.5; 15 0,-5.5; 16 1.27,-5.5; 17 2.54,-5.5; 18 3.81,-5.5; 26 3.81,5.5; 27 2.54,5.5; 28 1.27,5.5 | smd 2.2 x 0.76: 5 -5.5,3.81; 6 -5.5,2.54; 7 -5.5,1.27; 8 -5.5,0; 9 -5.5,-1.27; 10 -5.5,-2.54; 11 -5.5,-3.81; 19 5.5,-3.81; 20 5.5,-2.54; 21 5.5,-1.27; 22 5.5,0; 23 5.5,1.27; 24 5.5,2.54; 25 5.5,3.81
SOT23-6P65_200X110L30X25N_BSS138PS,115 = smd 0.39 x 0.96: 1 -0.65,-0.88; 2 0,-0.88; 3 0.65,-0.88; 4 0.65,0.88; 5 0,0.88; 6 -0.65,0.88
SOP8P65_300X490X111L53X30N = smd 0.45 x 1.22: 1 -0.975,-2.115; 2 -0.325,-2.115; 3 0.325,-2.115; 4 0.975,-2.115; 5 0.975,2.115; 6 0.325,2.115; 7 -0.325,2.115; 8 -0.975,2.115
LCCS16P127_736X736X279L127X50N = smd 0.56 x 1.83: 1 -1.905,-3.275; 2 -0.635,-3.275; 3 0.635,-3.275; 4 1.905,-3.275; 9 1.905,3.275; 10 0.635,3.275; 11 -0.635,3.275; 12 -1.905,3.275 | smd 1.83 x 0.56: 5 3.275,-1.905; 6 3.275,-0.635; 7 3.275,0.635; 8 3.275,1.905; 13 -3.275,1.905; 14 -3.275,0.635; 15 -3.275,-0.635; 16 -3.275,-1.905
SOT23-5P65_210X110L40X22N_LM20 = smd 0.38 x 1.11: 1 -0.65,-0.9; 2 0,-0.9; 3 0.65,-0.9; 4 0.65,0.9; 5 -0.65,0.9

### Placement (x,y rotation side)
C14  73.98,72.39 270 top
C17  24.13,29.21 90 top
C18  19.05,29.21 270 top
C21  24.13,18.41 90 top
C22  19.05,18.41 270 top
C25  24.13,40.01 90 top
C26  19.05,40.01 270 top
C31  6.99,21.59 0 top
C32  5.71,25.4 270 top
C33  10.16,14.61 180 top
C34  30.48,25.4 180 top
C36  24.13,62.87 90 top
C37  21.59,62.87 90 top
C38  24.13,50.16 90 top
C39  16.51,50.16 90 top
C40  16.51,62.87 270 top
C41  39.69,37.15 0 top
C42  29.21,48.9 270 top
C43  31.75,48.9 270 top
C44  29.21,57.78 90 top
C45  31.75,57.78 90 top
C46  36.83,48.9 270 top
C47  39.05,48.9 270 top
C48  67.35,34.96 180 top
C49  78.78,43.07 0 top
C50  78.71,41.72 0 top
C51  83.69,60.05 0 top
C52  59.52,51.27 0 top
C53  30.8,35.88 180 top
C54  30.8,42.86 180 top
C55  30.16,45.09 180 top
C56  40.32,34.92 0 top
C57  30.16,33.66 180 top
C58  63.53,52.87 0 top
C59  63.13,55.44 0 top
C60  63.13,58.88 0 top
C61  67.68,55.93 90 top
C62  55.99,51.79 90 top
C63  76.61,34.16 0 top
D4  13.34,59.05 180 top
D5  13.34,53.98 0 top
D6  25.08,45.09 180 top
JP1  49.85,11.11 0 top
JP2  11.43,22.86 180 top
JP3  41.27,11.11 0 top
JP4  82.55,75.25 90 top
MH1  6.5,6.5 0 top
MH2  84.5,6.5 0 top
MH3  84.5,84.5 0 top
MH4  6.5,84.5 0 top
Q3  78.93,46.28 270 top
Q5  61.21,57.15 90 top
R8  76.2,72.39 270 top
R10  81.24,60.03 180 top
R11  68.75,57.23 90 top
R12  48.9,52.2 180 top
R13  48.9,53.85 0 top
R14  42.35,53.02 90 top
R17  83.55,50.42 180 top
R18  48.9,46.48 180 top
R19  48.9,48.13 0 top
R20  42.35,47.31 90 top
R21  21.59,24.77 270 top
R22  24.13,24.77 270 top
R23  16.51,29.21 270 top
R24  16.51,24.77 270 top
R25  26.67,29.21 270 top
R26  19.05,24.77 90 top
R29  84.62,46.01 45 top
R30  8.26,39.37 180 top
R31  5.71,14.61 180 top
R32  30.48,20.64 90 top
R33  83.53,49.12 180 top
R36  21.59,13.97 270 top
R37  26.67,50.16 90 top
R38  24.13,13.97 270 top
R39  16.51,18.41 270 top
R40  16.51,13.97 270 top
R41  26.67,18.41 270 top
R42  19.05,13.97 90 top
R43  16.51,67.31 270 top
R44  19.05,67.31 90 top
R45  16.51,45.72 90 top
R46  19.05,45.72 270 top
R47  21.59,45.72 90 top
R48  21.59,50.16 270 top
R49  21.59,67.31 270 top
R50  48.9,49.34 180 top
R51  48.9,50.99 0 top
R52  42.35,50.16 90 top
R53  24.13,67.31 90 top
R54  19.05,50.16 90 top
R55  19.05,62.87 270 top
R57  26.67,62.87 270 top
R58  26.67,67.31 270 top
R59  48.9,43.62 180 top
R60  48.9,45.28 0 top
R61  42.35,44.45 90 top
R67  21.59,35.56 270 top
R68  24.13,35.56 270 top
R69  16.51,40.01 270 top
R70  16.51,35.56 270 top
R71  26.67,40.01 270 top
R72  19.05,35.56 90 top
S4  80.64,67.31 270 top
S6  80.64,57.15 270 top
SJ1  8.57,25.4 90 top
TP4  33.02,69.85 0 top
TP5  27.94,69.85 90 top
TP6  27.62,13.65 0 bottom
TP7  28.89,31.43 180 top
U2  34.29,39.37 0 top
U3  21.59,29.21 0 top
U5  34.29,53.34 0 top
U6  31.11,64.77 180 top
U7  21.59,56.52 180 top
U8  21.59,18.41 0 top
U10  21.59,40.01 0 top
U$1  67.94,44.45 180 top
U$2  88.27,38.73 270 top
U$3  65.09,75.25 180 top
U$7  45.4,53.02 270 top
U$9  45.4,47.31 270 top
U$10  7.62,17.78 90 top
U$11  7.94,32.38 0 top
U$13  45.4,50.16 270 top
U$14  30.48,28.57 180 top
U$17  45.4,44.45 270 top

### Tracks (layer width: path | path; a pad name or v marks a point on that pad's centre or on a via)
0_DEGREES
  Top 0.152: U5.2 28.26,54.93 26.15,57.03 18.41,57.03 17.78,57.67 U7.7 17.78,60.33 17.46,60.64 16.83,60.64 16.51,60.96 C40.2 R55.2
5V_!CS!_SUN_Z-
  Top 0.203: 44.14,49.52 U$13.3 43.2,49.52 43.18,49.53 43.11,49.53 42.98,49.66 R52.1 41.77,49.66 41.59,49.85 41.59,52.7 39.37,54.93 U5.15
5V_SPI_CLK
  Top 0.203: U$7.3 43.2,52.37 43.18,52.39 43.11,52.39 42.98,52.52 R14.1 39.31,55.56 U5.16
5V_SPI_MISO
  Top 0.203: U$17.3 44.51,43.82 43.11,43.82 42.98,43.95 R61.1 41.71,43.95 40.44,45.22 40.44,51.43 38.85,53.02 U5.12
5V_SPI_MOSI
  Top 0.203: U$9.3 44.51,46.67 43.11,46.67 42.98,46.81 R20.1 41.71,46.81 41.09,47.43 41.09,52.39 39.19,54.29 U5.14
120_DEGREES
  Top 0.152: R54.2 C39.2 16.51,52.07 16.83,52.39 17.46,52.39 17.78,52.7 U7.8 17.78,55.56 18.41,56.2 26.02,56.2 27.93,54.29 U5.3
240_DEGREES
  Top 0.152: 23.81,51.33 C38.2 R37.2 26.67,52.07 26.35,52.39 25.72,52.39 25.4,52.7 U7.14 26.89,54.09 27.32,53.66 U5.4
!CS!_HMC1053  (1 unrouted)
  Top 0.203: U$1.36 56.12,41.7 55.38,40.96 U2.15
!CS!_SUN_X+  (1 unrouted)
!CS!_SUN_X-  (1 unrouted)
!CS!_SUN_Y+  (1 unrouted)
!CS!_SUN_Y-  (1 unrouted)
!CS!_SUN_Z-  (via drill 0.35)  (1 unrouted)
  Top 0.203: U$13.6 46.92,50.81 47.09,50.99 R51.1 48.4,50.35 48.58,50.16 51.12,50.16 53.66,47.62 v53.66,42.23 | v56.52,39.37 57.15,38.73 70.42,38.73 70.69,38.45 U$1.56
  Bottom 0.203: v53.66,42.23 53.66,41.27 55.56,39.37 v56.52,39.37
+3V3  (via drill 0.3 pad 0.66, 0.35)  (35 unrouted)
  Top 0.152: 5.74,26.67 C32.1 5.71,27.3 6.03,27.62 U$11.1 | R31.2 v2.86,14.61 | v76.2,74.61 v76.2,74.62 | v19.05,31.14 C18.1 19.11,30.12 U3.5 | R23.1 v16.51,31.43 | v19.05,20.35 C22.1 19.11,19.32 U8.5 | R39.1 v16.51,20.64 | v19.05,41.94 C26.1 19.11,40.91 U10.5 | R69.1 v16.51,42.23 | 28.57,25.4 v28.55,25.4
  Top 0.203: v68.02,33.91 68.02,33.88 | 56.01,52.67 C62.+ | v50.48,53.85 R13.2 | R12.1 v50.48,52.2 | U$7.5 v47.43,53.02 | v43.37,53.02 U$7.2 | v50.48,49.34 R50.1 | v50.48,50.99 R51.2 | v43.37,50.16 U$13.2 | v43.37,47.31 U$9.2 | U$9.5 v47.43,47.31 | v50.48,48.13 R19.2 | v50.48,46.48 R18.1 | U$17.2 v43.37,44.45 | v50.48,43.62 R59.1 | v47.43,44.45 U$17.5 | v50.48,45.28 R60.2 | C48.1 67.69,35.22 U$1.50 | U2.7 U2.8 31.74,35.97 C53.1 31.65,33.74 C57.1 v32.99,33.66 | 28.57,25.4 C34.2 29.63,26.14 29.83,26.34 U$14.4 29.78,27.73 | v32.99,45.09 31.75,45.09 | 31.75,45.09 C55.1 | U2.1 31.74,42.85 31.75,42.86 C54.1 31.75,42.97 31.75,45.09 | v37.49,34.92 C56.1 38.84,35.01 C41.1 U2.9 | R8.1 v76.2,74.61
  Top 0.254: 67.69,35.27 C48.1 67.95,34.92 68,34.92 68,33.93 v68.02,33.91 | 58.93,53.8 63.45,53.8 64.19,53.05 | 64.19,52.85 64.19,53.05 | 64.19,53.05 65.02,53.05 v65.05,53.09 | U$1.18 64.19,52.8
  Top 0.305: 64.19,52.85 C58.2 64.19,52.8 | v81.86,46.99 81.86,48.72 79.12,51.46 79.12,55.63 S6.1 R10.2 | 58.93,53.8 58.04,53.8 v57.56,53.31 57.41,53.17 C62.+ | v84.81,43.48 84.81,41.58 84.8,41.57 85.72,40.64 88.9,40.64 89.75,39.78 89.75,35.15 U$2.3
  Bottom 0.305: v81.86,46.99 84.81,44.04 v84.81,43.48
  other vias: 47.43,50.16
+4V5  (via drill 0.35)
  Top 0.152: v29.21,50.83 C42.1 C43.1 31.75,51.1 U5.8 | U6.6 v30.48,60.78
  Bottom 0.152: v30.48,60.78 30.48,55.88 29.84,55.24 29.84,53.34 29.21,52.7 v29.21,50.83
+5V  (via drill 0.35)  (13 unrouted)
  Top 0.152: R46.2 v19.05,43.81 | R44.2 v19.05,69.22 | C36.1 C37.1 U7.4 | U5.1 31.74,56.92 C45.1 C44.1 v29.21,55.85 | v39.05,50.83 C47.1 C46.1 36.74,49.74 36.84,49.85 U5.9 | U6.2 v31.75,68.98 | U6.3 v30.48,68.98 | U5.7 30.48,51.75 v30.16,51.44 | R48.2 v21.59,48.23
  Top 0.203: R14.2 v42.35,54.4 | R52.2 v42.35,51.55 | v42.35,45.83 R61.2 42.74,44.57 | R20.2 v42.35,48.69
  Top 0.254: 77.98,37.38 77.83,37.54 74.78,37.54 73.18,39.14 73.18,41.12 73.75,41.7 U$1.65
  Top 0.305: 77.83,37.54 86.92,37.54 U$2.2 | C63.+ 77.98,37.38
AVCC1  (1 unrouted)
  Top 0.203: 67.68,55.28 68.01,55.28 68.76,56.03 68.76,56.56 R11.1
  Top 0.305: 67.69,55.26 C61.1 67.68,55.28
B_MEAS_X  (1 unrouted)
  Top 0.152: 22.28,19.36 C21.2 R41.1 26.35,19.68 26.35,26.04
  Top 0.203: 26.35,26.04 27.94,27.62 27.94,31.11 26.04,33.02 26.04,35.88 29.84,39.69 U2.4
B_MEAS_Y
  Top 0.203: U3.4 22.28,30.16 C17.2 R25.1 26.67,31.75 25.4,33.02 25.4,35.88 29.84,40.32 U2.3
B_MEAS_Z  (1 unrouted)
  Top 0.203: U2.2 R71.1 C25.2 22.28,40.95
BRD_TEMP_MEAS
  Top 0.203: U2.5 29.83,39.05 26.67,35.89 26.67,33.02 27.46,32.23 28.1,32.23 TP7.TP 29.83,30.5 U$14.3
GND  (via drill 0.3 pad 0.66, 0.35)  (75 unrouted)
  Top 0.152: U$11.14 v3.17,33.02 | U$11.8 v12.66,34.29 | U$11.5 v12.7,30.48 | R30.1 v11.11,39.37 | C32.2 v5.71,23.47 | v30.48,17.78 R32.1 | v12.09,14.61 C33.1 | U$11.11 v7.3,37.15 | R45.1 v16.51,43.81 | v21.59,43.81 R47.1 | v21.59,69.22 R49.1 | v24.13,69.22 R53.2 | v16.51,69.22 R43.1 | U7.11 v21.59,52.52 | C45.2 v31.75,59.72 | C44.2 v29.21,59.72 | C47.2 v39.05,46.96 | C46.2 v36.83,46.96 | U6.4 v29.21,68.98 | v38.27,52.39 U5.11 U5.10 | U5.6 v30.3,52.39 | R58.1 v26.67,69.22 | R57.1 v26.67,64.8 | C36.2 v24.13,64.8 | C37.2 v21.59,64.8 | C18.2 v19.05,27.28 | R24.2 v16.51,22.54 | C22.2 v19.05,16.48 | R40.2 v16.51,11.75 | C26.2 v19.05,38.07 | R70.2 v16.51,33.34 | U$10.3 v10.88,18.11 | 32.38,25.4 v32.41,25.4
  Top 0.203: C61.2 67.68,58.2 v67.11,58.78 | v55.85,48.84 55.99,48.98 C62.- 56.31,50.42 | C52.1 58.13,51.27 v57.94,51.26 | C49.2 79.44,43.05 v80.29,43.05 | C50.2 79.4,41.68 v80.29,41.71 | v80.75,46.28 Q3.2 79.03,46.38 82.12,46.38 82.47,46.74 82.47,47.24 82.27,47.44 82.27,48.98 79.55,51.7 79.55,52.6 80.19,53.24 82.52,53.24 84.81,50.95 84.81,49.89 85.81,48.9 | v85.29,60.05 C51.2 | R33.1 v85.06,49.12 | U$1.19 63.7,51.88 63.5,52.07 v62.23,52.07 | U2.6 v30.3,38.42 | v38.27,38.42 U2.11 U2.10 | C53.2 v28.87,35.88 | v41.62,37.15 C41.2 | C54.2 v28.87,42.86 | C57.2 28.6,33.66 | 28.6,33.66 | 28.6,33.66 v27.33,33.66 | U$14.2 v30.48,30.72 | v31.11,26.59 31.11,27.66 U$14.5 | C34.1 32.38,25.4 | C55.2 | C55.2 v27.33,45.09 | C42.2 v29.21,46.96 | v31.75,46.96 C43.2 | v43.15,34.92 C56.2 | C14.1 v73.98,74.62
  Top 0.254: C48.2 66.75,34.98 66.7,34.98 66.7,33.99 v66.7,33.96 | C63.- 75.23,35.49 v75.18,35.53
  Top 0.305: C58.1 61.86,52.87 v61.82,52.91
  other vias: 61.24,55.42 61.24,58.88 76.23,45.26 57.76,57.05 58.09,58.75 58.27,55.24 59.84,55.17 62.87,57.12 59.87,58.67 65.18,54.66 76.23,46.41 66.5,53.9
  pour Top (isolate 0.203): 67.69,50.27 67.69,59.05 66.93,59.84 58.06,59.87 57.1,58.95 57.1,55.22 58.01,54.28 64.82,54.28 66.19,52.91 66.19,50.27
  pour Top (isolate 0.203): 73.79,43.18 77.09,43.15 77.67,43.74 80.21,43.76 80.98,44.53 80.98,48.11 80.31,48.77 77.52,48.77 76.78,48.03 76.78,45.03 76.48,44.73 73.79,44.73
HMC1053_RESET  (via drill 0.35)
  Top 0.152: 9.74,17.46 U$10.2 10.48,17.45 10.79,17.14 v11.43,17.14 | U$10.4 9.73,19.04 10.08,19.39 v10.72,19.39
  Bottom 0.152: v10.72,19.39 11.48,18.63 11.48,17.85 11.43,17.8 v11.43,17.14 12.7,15.88 25.4,15.88 TP6.TP
IN2+BIAS
  Top 0.152: R43.2 R44.1 19.9,66.46 20.32,66.04 U7.5
IN3+BIAS
  Top 0.152: R45.2 R46.1 19.9,46.57 20.32,46.99 U7.10
IN4+BIAS
  Top 0.152: U7.12 22.86,52.7 22.07,51.92 21.75,51.92 21.59,51.75 R48.1 21.8,50.8 22.54,50.8 22.86,50.48 22.86,46.99 22.44,46.57 R47.2
MAG_Y_FIN  (1 unrouted)
MAG_Y_RIN  (1 unrouted)
MAG_Z_FIN  (2 unrouted)
MAG_Z_RIN  (2 unrouted)
MTI_DRDY  (1 unrouted)
N$7  (1 unrouted)
  Top 0.203: R8.2 U$3.5
N$12
  Top 0.203: S6.2 83.11,52.15 84.15,51.1 R17.1
N$14
  Top 0.152: 44.77,53.67 U$7.1
  Top 0.203: R12.2 47.76,52.2 47.58,52.37 U$7.4 45.54,52.37 45.4,52.51 45.4,53.53 45.26,53.67 44.77,53.67
N$20
  Top 0.152: R24.1 16.83,25.71 | 19.05,24.14 R26.1 18.09,23.82 17.78,24.13 17.78,25.41 17.47,25.71 R24.1 | R23.2 R24.1
N$21  (1 unrouted)
  Top 0.152: R25.2 C17.1 R22.1
  Top 0.203: C17.1 22.28,28.26
N$23
  Top 0.152: R26.2 R21.1 21.59,26.45 20.94,27.1 U3.1
N$26  (via drill 0.35)
  Top 0.152: R49.2 22.44,66.46 22.86,66.04 v22.86,65.41 | U7.3 22.86,59.05 | 22.86,59.05 v22.86,60.73 | U7.2 22.98,58.94 22.86,59.05
  Bottom 0.152: v22.86,65.41 v22.86,60.73
N$27
  Top 0.152: R53.1 25.29,65.3 25.29,59.05 U7.1
N$28  (1 unrouted)
  Top 0.152: C38.1 23.39,49.31 23.18,49.53 23.18,51.44 24.13,52.39
  Top 0.203: 24.13,52.39 24.13,53.34 | C38.1 R37.1 26.67,47.94 26.35,47.62 25.4,47.62 25.08,47.31 D6.1
N$30
  Top 0.203: U$9.1 45.26,47.96 45.4,47.82 45.4,46.8 45.54,46.66 U$9.4 47.23,46.66 47.41,46.48 R18.2
N$31
  Top 0.152: R54.1 C39.1 14.61,49.31 13.34,50.59 D5.1 | U7.9 19.05,52.39 20,51.44 20,49.53 19.79,49.31 R54.1 | R54.1 19.47,49.31
N$32  (1 unrouted)
  Top 0.152: R55.1 C40.1 14.61,63.72 13.34,62.45 D4.1 | R55.1 19.05,63.5 19.05,63.49 | U7.6 | 19.05,59.69 19.05,60.64 19.83,61.42 19.83,63.57 19.68,63.72 R55.1
N$33
  Top 0.152: U6.5 29.09,62.23 28.57,62.23 27.94,62.87 TP5.TP
N$34
  Top 0.152: U6.1 TP4.TP
N$35
  Top 0.152: C31.2 8.41,21.61 8.26,21.61 | SJ1.1 8.57,23.18 8.38,22.99 C31.2 | JP2.2 C31.2
N$36  (via drill 0.35)
  Top 0.152: U$11.15 v3.22,31.75 1.91,33.06 1.91,35.87 v5.4,39.37 R30.2 | v7.3,27.62 U$11.2 | U$11.7 v12.7,33.02
  Bottom 0.152: v12.7,33.02 13.97,34.29 13.97,35.56 10.79,38.73 6.04,38.73 v5.4,39.37 | v7.3,27.62 7.3,29.53 5.08,31.75 v3.22,31.75
N$37  (via drill 0.35)  (1 unrouted)
  Top 0.152: U$11.6 v12.66,31.75 | U$11.3 8.57,26.35 8.38,26.16 8.38,25.92 SJ1.2 | SJ1.2 8.57,26.14 | SJ1.2 8.7,26.04 10.79,26.04 11.43,25.4 JP2.1
N$38  (via drill 0.35)  (2 unrouted)
  Top 0.152: U$10.5 U$10.8 5.5,21.59 C31.1 | U$10.7 v4.36,17.45
N$39
  Top 0.152: C33.2 | C33.2 9.31,15.24 9.73,15.66 U$10.1 | R31.1 C33.2
N$40  (via drill 0.35)
  Top 0.152: R32.2 v30.48,23.49
  Top 0.203: U$14.1 32.07,29.48 32.33,29.21 v32.38,29.21
  Bottom 0.152: v32.38,29.21 32.38,26.67 30.48,24.77 v30.48,23.49
N$41
  Top 0.152: R57.2 26.67,60.96 27.3,60.33 29.84,60.33 30,60.17 30.96,60.17 31.75,60.96 U6.7
N$42
  Top 0.203: U$13.1 45.26,50.81 45.4,50.67 45.4,49.66 45.54,49.52 U$13.4 46.92,49.52 47.09,49.34 R50.2
N$43  (via drill 0.35)  (1 unrouted)
  Top 0.152: U6.8 v33.02,60.78
N$48
  Top 0.203: U$17.1 45.26,45.1 45.4,44.96 45.4,43.94 45.54,43.8 U$17.4 46.92,43.8 47.09,43.62 R59.2
N$49
  Top 0.152: R40.1 16.83,14.92 | 19.05,13.34 R42.1 18.09,13.02 17.78,13.34 17.78,14.61 17.47,14.92 R40.1 | R39.2 R40.1
N$50  (1 unrouted)
  Top 0.152: R41.2 C21.1 | C21.1 22.28,17.46 | C21.1 R38.1
N$52
  Top 0.152: R42.2 R36.1 21.59,15.65 20.94,16.3 U8.1
N$59
  Top 0.152: R70.1 16.83,36.51 | 19.05,34.93 R72.1 18.09,34.61 17.78,34.92 17.78,36.2 17.47,36.51 R70.1 | R69.2 R70.1
N$60  (1 unrouted)
  Top 0.203: 22.28,39.05 C25.1 | C25.1 R71.2 | C25.1 R68.1
N$62
  Top 0.152: R72.2 R67.1 21.59,37.24 20.94,37.89 U10.1
OUT_A_N
  Top 0.152: U$11.10 8.57,34.22 10.41,32.38 13.34,32.38 14.61,31.11 14.61,22.35 15.37,21.59 20.42,21.59 21.59,22.76 R21.2
OUT_A_P  (via drill 0.35)  (1 unrouted)
  Top 0.152: v3.17,30.48 3.81,30.48 | 22.81,21.44 22.66,21.29 20.55,21.29 | 14.3,22.23 14.3,30.15 13.34,31.11 6.35,31.11 5.71,30.48 U$11.16 | 14.3,22.23 15.09,21.44 | R22.2 24.13,22.76 22.81,21.44 | 22.81,21.44 20.7,21.44 20.55,21.29 | 20.55,21.29 15.24,21.29 15.09,21.44 | 15.09,21.44 | 15.09,21.44 14.3,22.23 | 14.3,22.23
OUT_B_N
  Top 0.152: R36.2 21.59,11.96 20.42,10.79 15.54,10.79 13.64,12.7 13.64,26.8 11.33,29.11 U$11.4
OUT_B_P  (via drill 0.35)
  Top 0.152: U$11.12 v6.03,37.15 | v12.06,27.3 13.34,26.04 13.34,12.57 15.42,10.49 22.66,10.49 24.13,11.96 R38.2
  Bottom 0.152: v6.03,37.15 6.44,37.15 6.87,36.72 6.87,33.13 12.06,27.94 v12.06,27.3
OUT_C_N
  Top 0.152: 9.84,36.51 U$11.9 10.48,35.66 10.9,36.09 12.37,36.09 12.45,36.17 12.95,36.17 13.31,35.81 13.31,35.59 16.51,32.38 20.42,32.38 21.59,33.55 R67.2
OUT_C_P  (via drill 0.35)
  Top 0.152: U$11.13 v3.17,34.29 | R68.2 24.13,33.55 22.66,32.08 16.18,32.08 v12.7,35.56
  Bottom 0.152: v3.17,34.29 3.17,35.15 5.78,37.75 10.51,37.75 v12.7,35.56
P1.7/CTS  (via drill 0.35)
  Top 0.203: U$2.5 79.06,28.57 v76.83,30.8 | v76.2,36.51 75.25,36.51 66.06,45.7 U$1.28
  Bottom 0.203: v76.83,30.8 76.83,35.88 v76.2,36.51
P4.4/UCA1TXD
  Top 0.203: U$2.7 81.64,23.5 68.19,36.94 U$1.51
P4.5/UCA1RXD
  Top 0.203: U$2.6 79.89,26.04 68.69,37.23 U$1.52
P5.2/XT2IN1
  Top 0.203: Q3.3 77.78,44.78 76.69,43.7 U$1.69
P5.3/XT2OUT1
  Top 0.203: Q3.1 77.88,47.78 77.32,47.22 77.32,45.03 76.48,44.2 75.56,44.2 74.77,44.2 U$1.70
P5.4/XIN1
  Top 0.203: C60.2 64.39,58.88 Q5.P2 66.36,57.62 66.75,57.23 66.75,54.74 67.19,54.29 U$1.12
P5.5/XOUT1  (1 unrouted)
  Top 0.203: C59.2 64.4,55.44 Q5.P1 | Q5.P1 65.64,56.63 | 66.7,51.28 66.7,52.7 65.84,53.57 65.84,56.49 Q5.P1
P6.7/RTS  (via drill 0.35)
  Top 0.203: U$2.4 78.42,31.11 77.15,32.38 74.61,32.38 v71.12,35.88 | U$1.4 71.19,47.7 70.48,46.99 70.48,43.5 v70.8,43.18
  Bottom 0.203: v71.12,35.88 71.12,43.18 v70.8,43.18
RST/SBWTDIO  (via drill 0.35)
  Top 0.203: R10.1 81.76,59.9 | C51.1 83.03,60.03 R10.1 | R10.1 81.92,60.11 81.92,61.04 81.64,61.32 | 81.64,61.32 S4.2 | 81.64,61.32 81.28,60.96 79.69,60.96 76.52,57.78 76.52,47.62 76.09,47.2 U$1.76 72.6,47.2 71.75,46.35 v71.75,43.81 | v71.75,32.07 82.87,20.95 U$2.8
  Bottom 0.203: v71.75,43.81 v71.75,32.07
TARGET_DP  (1 unrouted)
  Top 0.203: R29.2 85.06,46.67
TARGET_PUR  (1 unrouted)
  Top 0.203: 74.76,40.69 73.76,40.69 73.66,40.59 73.66,39.22 74.73,38.15 75.31,38.15 76.96,39.8 80.7,39.8 82.14,41.25 82.14,43.54 R29.1 | R17.2 82.95,49.1 R33.2 82.93,47.98 82.93,47.81 82.93,46.86 R29.1 | R29.1 84.1,45.36 | R29.1 83.74,46.04
TARGET_VUSB1
  Top 0.203: C50.1 77.64,42.2 U$1.66
TEST/SBWTCK  (via drill 0.35)
  Top 0.203: U$2.9 84.14,18.41 v72.39,30.16 | v72.71,44.45 72.96,44.7 U$1.71
  Bottom 0.203: v72.39,30.16 72.39,44.13 v72.71,44.45
UCA0RXD  (via drill 0.35)
  Top 0.203: JP4.1 75.25,65.69 v75.25,52.07 | U$1.41 63.16,37.78 v62.55,37.78
  Bottom 0.203: v75.25,52.07 75.25,51.44 72.45,48.64 70.23,48.64 63.82,42.23 63.82,40.32 62.55,39.05 v62.55,37.78
UCA0TXD  (via drill 0.35)
  Top 0.203: 61.33,39.69 U$1.40 60.02,39.7 v59.69,39.37 | JP4.2 82.45,73.4 82.09,73.4 78.48,69.79 | 78.48,69.79 74.61,65.92 v74.61,53.34 | 78.48,69.79
  Bottom 0.203: v74.61,53.34 74.61,51.75 72.07,49.21 70.17,49.21 63.18,42.23 63.18,40.96 61.91,39.69 60.01,39.69 v59.69,39.37
UCB0_SPI_CLK  (via drill 0.35)  (2 unrouted)
  Top 0.203: U$7.6 47.58,53.67 47.76,53.85 R13.1 48.4,53.2 48.58,53.02 51.12,53.02 54.61,49.53 v54.61,41.59 U2.16 | U$1.39 58.82,40.2 58.62,40.01 v57.47,40.01 | v57.47,40.01
  Bottom 0.203: v54.61,41.59 55.24,41.59 56.83,40.01 v57.47,40.01
UCB0_SPI_MISO  (via drill 0.35)  (2 unrouted)
  Top 0.203: U$17.6 47.31,45.1 47.48,45.28 R60.1 | R60.1 48.52,45.4 | R60.1 48.4,44.63 48.58,44.45 51.12,44.45 51.44,44.13 v51.44,42.86 | U2.12 v51.44,39.05 54.93,39.05 56.58,40.7 U$1.38
  Bottom 0.203: v51.44,42.86 v51.44,39.05
UCB0_SPI_MOSI  (via drill 0.35)  (2 unrouted)
  Top 0.203: U$9.6 46.99,47.96 47.17,48.13 R19.1 48.4,47.49 48.58,47.31 51.12,47.31 52.7,45.72 v52.7,42.55 | U2.14 v52.7,40.32 55.53,40.32 56.41,41.2 U$1.37
  Bottom 0.203: v52.7,42.55 v52.7,40.32
V1
  Top 0.203: 77.81,42.7 C49.1 77.81,42.7 U$1.67
VCORE1  (1 unrouted)
  Top 0.305: C52.2 63.19,51.27

### Text on the board
tDocu: RST | BSL | GND | 5V | 3V3 | RTS >> | CTS << | RXD << | TXD >> | SBW RST | SBW TST